# Altium project LG-TRACKER.PrjPcb (part 1 of 2)
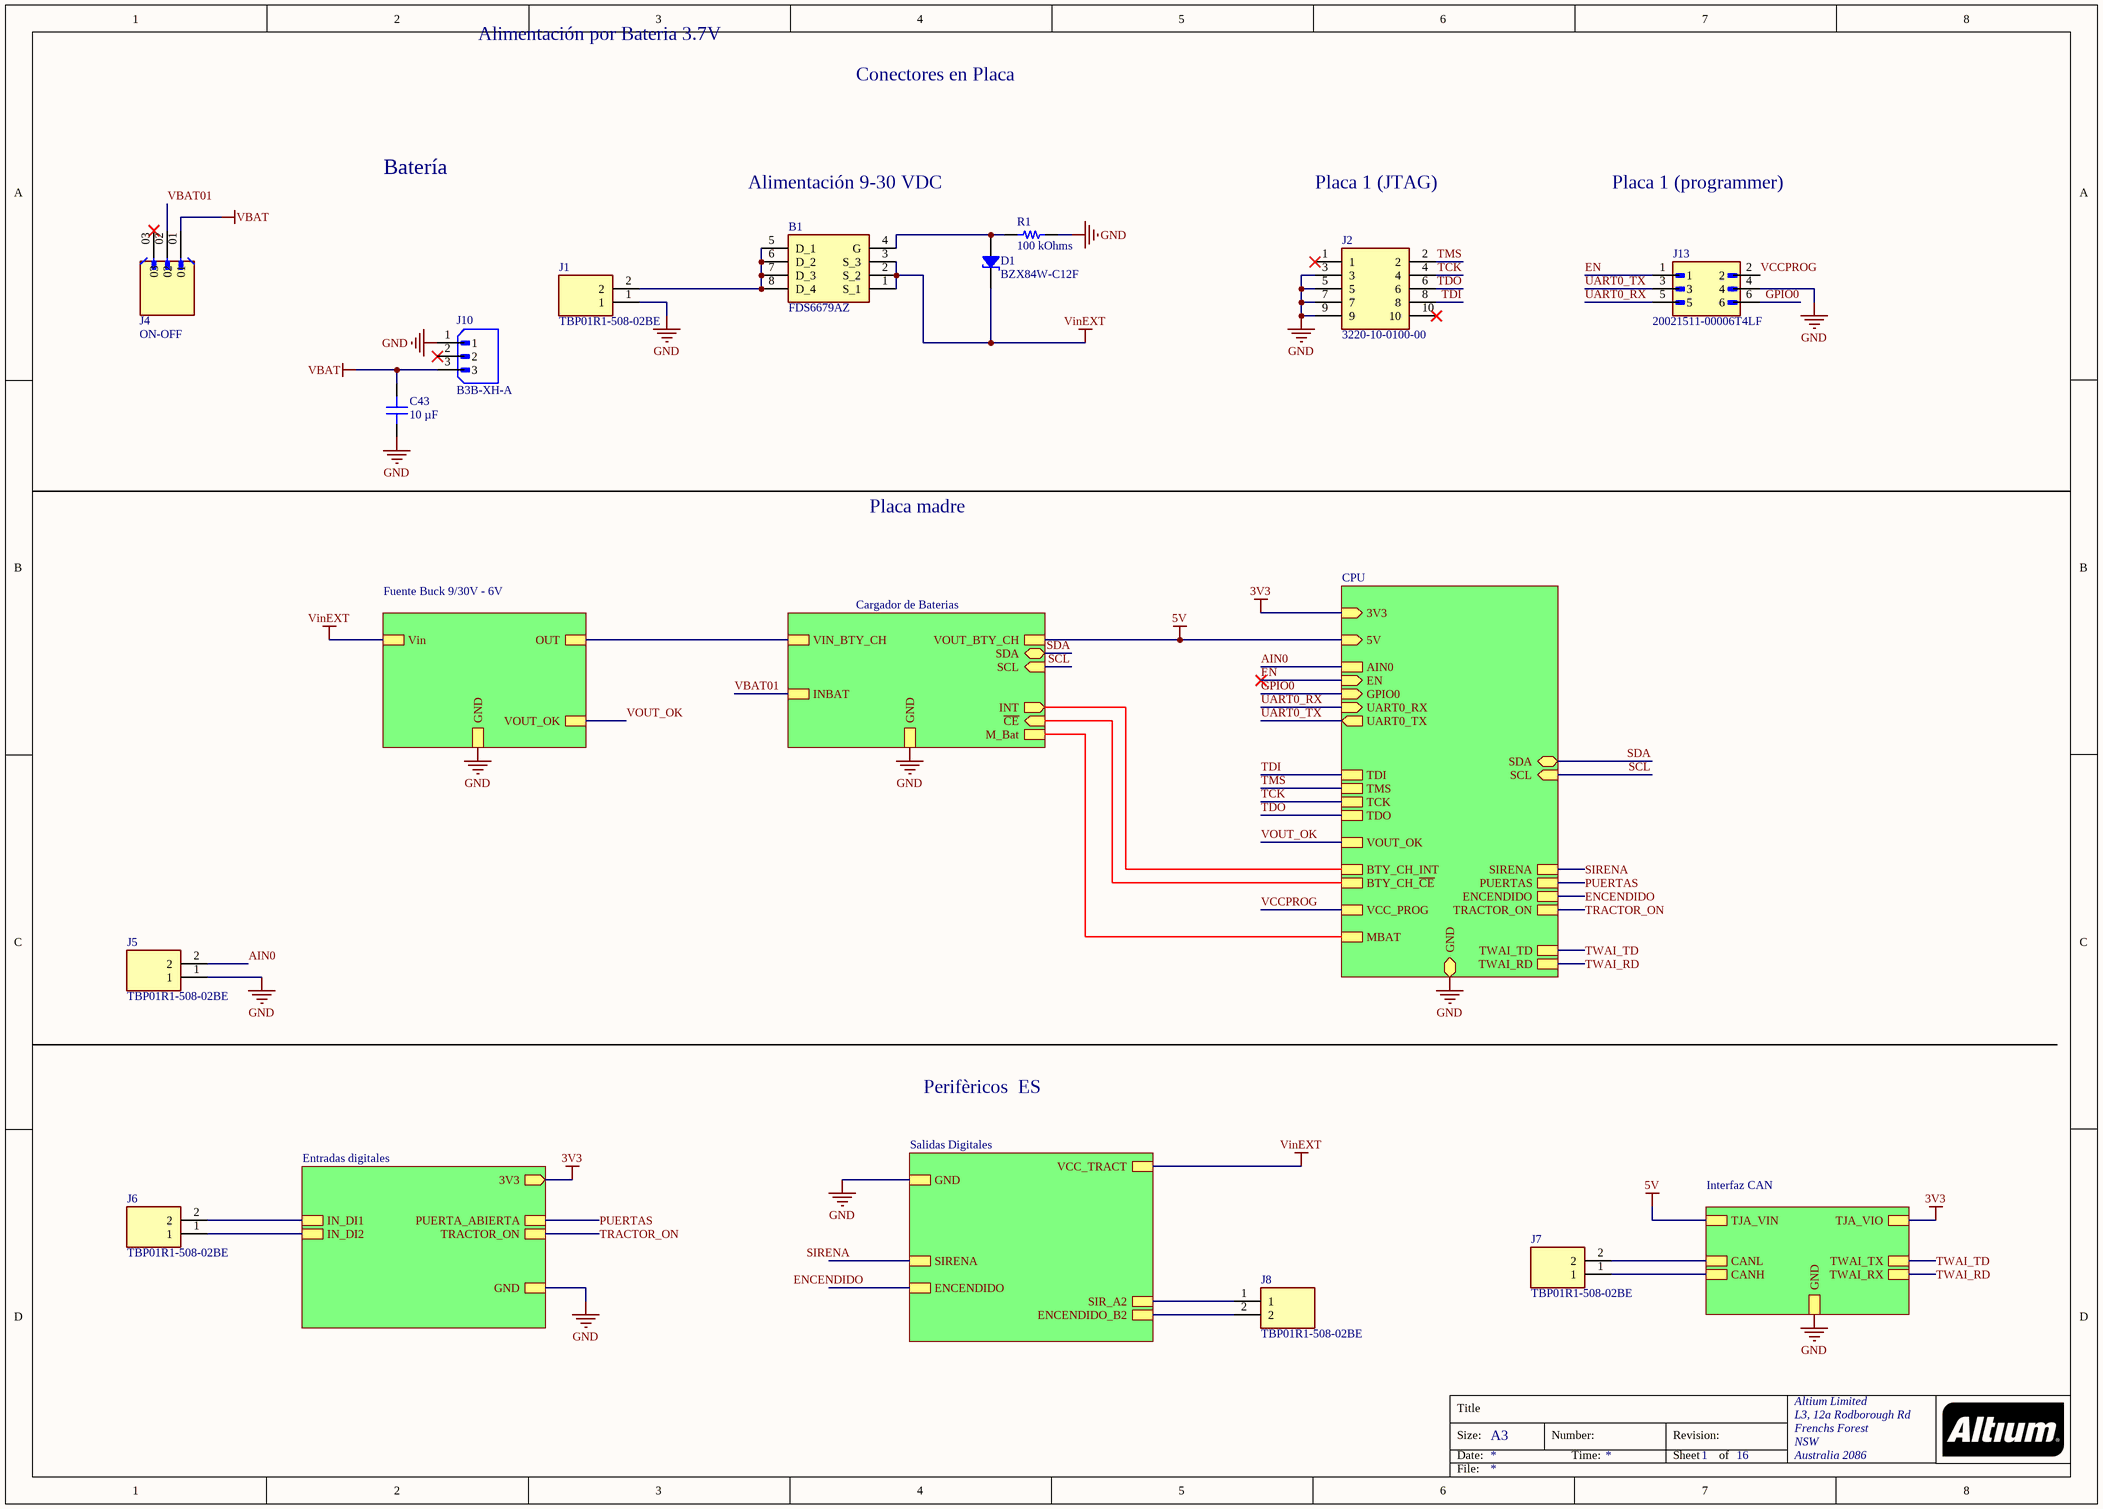
[diagram p0: LG_TRACKER_Block_Diagram.SchDoc]
8 sheets, 81 parts. Net scope: hierarchical (ports join the sheet entries above them; power ports are global).
Board file: LG_TRACKER_PCB.PcbDoc
Sheets:
  LG_TRACKER_Block_Diagram.SchDoc
    CPU = LG_TRACKER_CPU.SchDoc
      Microcontrolador = LG_TRACKER_Microcontroller.SchDoc
        Expansores de IO = LG_TRACKER_IO_Expanders.SchDoc
      GPS = LG_TRACKER_BG95.SchDoc
      Regulador lineal 3V3 = LG_TRACKER_Linear_Voltage_Regulator_3V3.SchDoc
      U_RTU_LMG_LoRa_Module = LG_TRACKER_LoRa_Module.SchDoc
    Salidas Digitales = LG_TRACKER_DO.SchDoc

## Sheet LG_TRACKER_Block_Diagram.SchDoc
size A3; Organization: Altium Limited; Address1: L3, 12a Rodborough Rd; Address2: Frenchs Forest; Address3: NSW; Address4: Australia 2086; SheetNumber: 1; SheetTotal: 16

### Parts
B1  FDS6679AZ  [SOIC127P600X175-8N]
C43  10 µF  [YAGEO RES 0805_2012]
D1  BZX84W-C12F  [SOT65P210X110-3N]
J1  TBP01R1-508-02BE  [CUI_TBP01R1-508-02BE]
J2  3220-10-0100-00  [322010010000]
J4  ON-OFF  [AMPHENOL_68001-203HLF]
J5  TBP01R1-508-02BE  [CUI_TBP01R1-508-02BE]
J6  TBP01R1-508-02BE  [CUI_TBP01R1-508-02BE]
J7  TBP01R1-508-02BE  [CUI_TBP01R1-508-02BE]
J8  TBP01R1-508-02BE  [CUI_TBP01R1-508-02BE]
J10  B3B-XH-A  [JST_B3B-XH-A]
J13  20021511-00006T4LF  [AMPHENOL_20021511-00006T4LF]
R1  100 kOhms  [RES 0603_1608]

### Sub-sheets
Cargador de Baterias = LG_TRACKER_Battery_Charger.SchDoc (file not in this document): SDA (bidir), SCL (in), INT (out), ~{CE} (in), GND, VIN_BTY_CH, VOUT_BTY_CH, M_Bat, INBAT
CPU = LG_TRACKER_CPU.SchDoc: GND (bidir), EN (in), GPIO0 (in), UART0_RX (in), UART0_TX (out), SDA (bidir), SCL (in), TDI, TMS, TCK, TDO, 5V (in), VOUT_OK, BTY_CH_INT, BTY_CH_~{CE}, MBAT, VCC_PROG, 3V3 (in), SIRENA, PUERTAS, ENCENDIDO, TRACTOR_ON, TWAI_TD, TWAI_RD, AIN0
Entradas digitales = LG_TRACKER-DI.SchDoc (file not in this document): IN_DI1, PUERTA_ABIERTA, GND, IN_DI2, TRACTOR_ON, 3V3 (out)
Fuente Buck 9/30V - 6V = LG_TRACKER_LM2596.SchDoc (file not in this document): Vin, GND, OUT, VOUT_OK
Interfaz CAN = LG_TRACKER_CAN.SchDoc (file not in this document): TWAI_TX, TWAI_RX, GND, TJA_VIO, TJA_VIN, CANL, CANH
Salidas Digitales = LG_TRACKER_DO.SchDoc: VCC_TRACT, SIR_A2, SIRENA, GND, ENCENDIDO_B2, ENCENDIDO

### Nets
3V3: sheet CPU/3V3, sheet Entradas digitales/3V3, sheet Interfaz CAN/TJA_VIO
5V: sheet CPU/5V, sheet Cargador de Baterias/VOUT_BTY_CH, sheet Interfaz CAN/TJA_VIN
GND: C43.1 J1.1 J2.3 J2.5 J2.7 J2.9 J5.1 J10.1 J13.4 R1.1 ; sheet CPU/GND, sheet Cargador de Baterias/GND, sheet Fuente Buck 9/30V - 6V/GND, sheet Entradas digitales/GND, sheet Salidas Digitales/GND, sheet Interfaz CAN/GND
VBAT: C43.2 J4.01 J10.3
VinEXT: B1.1(S_1) B1.2(S_2) B1.3(S_3) D1.2 ; sheet Fuente Buck 9/30V - 6V/Vin, sheet Salidas Digitales/VCC_TRACT
AIN0: J5.2 ; sheet CPU/AIN0
BTY_CH_~{CE}: sheet CPU/BTY_CH_~{CE}, sheet Cargador de Baterias/~{CE}
BTY_CH_INT: sheet CPU/BTY_CH_INT, sheet Cargador de Baterias/INT
EN: J13.1 ; sheet CPU/EN
ENCENDIDO: sheet CPU/ENCENDIDO, sheet Salidas Digitales/ENCENDIDO
ENCENDIDO_B2: J8.2 ; sheet Salidas Digitales/ENCENDIDO_B2
GPIO0: J13.6 ; sheet CPU/GPIO0
MBAT: sheet CPU/MBAT, sheet Cargador de Baterias/M_Bat
PUERTAS: sheet CPU/PUERTAS, sheet Entradas digitales/PUERTA_ABIERTA
SCL: sheet CPU/SCL, sheet Cargador de Baterias/SCL
SDA: sheet CPU/SDA, sheet Cargador de Baterias/SDA
SIR_A2: J8.1 ; sheet Salidas Digitales/SIR_A2
SIRENA: sheet CPU/SIRENA, sheet Salidas Digitales/SIRENA
TCK: J2.4 ; sheet CPU/TCK
TDI: J2.8 ; sheet CPU/TDI
TDO: J2.6 ; sheet CPU/TDO
TMS: J2.2 ; sheet CPU/TMS
TRACTOR_ON: sheet CPU/TRACTOR_ON, sheet Entradas digitales/TRACTOR_ON
TWAI_RD: sheet CPU/TWAI_RD, sheet Interfaz CAN/TWAI_RX
TWAI_TD: sheet CPU/TWAI_TD, sheet Interfaz CAN/TWAI_TX
UART0_RX: J13.5 ; sheet CPU/UART0_RX
UART0_TX: J13.3 ; sheet CPU/UART0_TX
VBAT01: J4.02 ; sheet Cargador de Baterias/INBAT
VCCPROG: J13.2 ; sheet CPU/VCC_PROG
VOUT_OK: sheet CPU/VOUT_OK, sheet Fuente Buck 9/30V - 6V/VOUT_OK
NetB1_4: B1.4(G) D1.1 R1.2
NetB1_5: B1.5(D_1) B1.6(D_2) B1.7(D_3) B1.8(D_4) J1.2
NetJ6_1: J6.1 ; sheet Entradas digitales/IN_DI2
NetJ6_2: J6.2 ; sheet Entradas digitales/IN_DI1
NetJ7_1: J7.1 ; sheet Interfaz CAN/CANH
NetJ7_2: J7.2 ; sheet Interfaz CAN/CANL
(unnamed): sheet Cargador de Baterias/VIN_BTY_CH, sheet Fuente Buck 9/30V - 6V/OUT

Not connected (* = marked no-connect by the designer): J2 1* 10*; J4 03*; J10 2*

### Notes on the sheet
- Alimentación por Bateria 3.7V
- Conectores en Placa
- Batería
- Alimentación 9-30 VDC
- Placa 1 (JTAG)
- Placa 1 (programmer)
- Placa madre
- Perifèricos  ES
- Title
- Size:
- Date:
- A3
- Number:
- Time:
- Revision:
- Sheet
- of
- File:

### Library data of the parts
B1 = FDS6679AZ: Max rDS(on) = 14.8m at VGS = -4.5V, ID = -11A; HBM ESD protection level of 6kV typical (note 3); High power and current handing capability; Extended VGS range (-25V) for battery applications; High performance trench technology for extremely lowrDS(on); High power and current handing capability; Max rDS(on) = 9.3mat VGS = -10V, ID = -13A; Manufacturer_Name: onsemi; Geometry.Height: 1.75mm; Mouser Part Number: 512-FDS6679AZ; Mouser Price/Stock: https://www.mouser.co.uk/ProductDetail/onsemi-Fairchild/FDS6679AZ?qs=vnwGVgFuQiZlXnM8io%2FtYg%3D%3D; Manufacturer_Part_Number: FDS6679AZ; Datasheet Link: https://www.onsemi.com/pub/Collateral/FDS6679AZ-D.PDF
C43 = CL21A106KOQNNNE: CAP CER 10UF 16V X5R 0805; manufacturer: Samsung Electro-Mechanics; Tolerance: ±10%; Part Number: CL21A106KOQNNNE; Value: 10 µF; Applications: General Purpose; Capacitance: 10 µF; componentlink1description: Datasheet; componentlink1url: http://www.samsungsem.com/kr/support/product-search/mlcc/CL21A106KOQNNNE.jsp; componentlink2description: DigiKey Link; componentlink2url: https://www.digikey.com/en/products/detail/samsung-electro-mechanics/CL21A106KOQNNNE/3886754; Device Package: 0805 (2012 Metric); lastupdated: 10/30/2023 7:13:57 PM; Lifecycle Status: Active; Minimum Order: 1; Mounting Type: Surface Mount, MLCC; Operating Temperature: -55°C ~ 85°C; Package / Case: 0805 (2012 Metric); packaging: TapeAndReel; partid: 14297; Part Status: Active; price: 0.01; series: CL; Size / Dimension: 0.079" L x 0.049" W (2.00mm x 1.25mm); Supplier 1: DigiKey; Supplier Part Number 1: 1276-1096-1-ND; Temperature Coefficient: X5R; Thickness (Max): 0.055" (1.40mm); Voltage - Rated: 16V
D1 = BZX84W-C12F: DIODE ZENER 12V 275MW SOT323; Manufacturer: Nexperia USA Inc.; Current - Reverse Leakage @ Vr: 100 nA @ 8 V; Impedance (Max) (Zzt): 25 Ohms; Tolerance: ±5%; Voltage - Forward (Vf) (Max) @ If: 900 mV @ 10 mA; Part Number: BZX84W-C12F; ComponentLink1Description: Datasheet; ComponentLink1URL: https://assets.nexperia.com/documents/data-sheet/BZX84W_SER.pdf; ComponentLink2Description: DigiKey Link; ComponentLink2URL: https://www.digikey.com/en/products/detail/nexperia-usa-inc/BZX84W-C12F/9380703; LastUpdated: 3/6/2024 20:01:46; Lifecycle Status: Active; Minimum Order: 1; Mounting Type: Surface Mount; Operating Temperature: 150°C (TJ); Package / Case: SC-70, SOT-323; Packaging: TapeAndReel; PartId: 873; Part Status: Active; Power - Max: 275 mW; Price: 0.01; Series: BZX84W; Supplier 1: DigiKey; Supplier Part Number 1: 1727-8288-1-ND; Supplier Device Package: SOT-323; Voltage - Zener (Nom) (Vz): 12 V
J1 J5-J8 = TBP01R1-508-02BE: 2~24 Poles, Pluggable, Receptacle, Horizontal, 5.08 Pitch, Terminal Block Connector; MF: Same Sky; SnapEDA_Link: https://www.snapeda.com/parts/TBP01R1-508-02BE/Same+Sky/view-part/?ref=snap; Package: None; Value: *; MP: TBP01R1-508-02BE; Check_prices: https://www.snapeda.com/parts/TBP01R1-508-02BE/Same+Sky/view-part/?ref=eda
J2 = 3220-10-0100-00: Connector Header Through Hole 10 position Shrouded 4 wall 0.050" (1.27mm); Manufacturer_Name: CNC Tech; Datasheet Link: https://datasheet.datasheetarchive.com/originals/dk/DKDS-7/133059.pdf; Height: 5.6mm; Manufacturer_Part_Number: 3220-10-0100-00; Arrow Part Number: 3220-10-0100-00; Arrow Price/Stock: https://www.arrow.com/en/products/3220-10-0100-00/cnc-tech-llc?region=nac
J4 = 68001-203HLF: Board to Board connector, Unshrouded vertical header, Through Hole, Single Row, , 3 Positions, 2.54 mm (0.100in) Pitch.; MF: Amphenol ICC; Package: None; Price: None; Check_prices: https://www.snapeda.com/parts/68001-203HLF/Amphenol+FCI/view-part/?ref=eda; Value: *; SnapEDA_Link: https://www.snapeda.com/parts/68001-203HLF/Amphenol+FCI/view-part/?ref=snap; MP: 68001-203HLF; Availability: In Stock; Purchase-URL: https://pricing.snapeda.com/search?q=68001-203HLF&ref=eda; ComponentLink1Description: New link; ComponentLink1URL: https://www.digikey.com/es/products/detail/amphenol-cs-fci/68001-203HLF/2023312
J10 = B3B-XH-A: Connector Header Through Hole 3 position 0.098 (2.50mm); MF: JST Sales; SnapEDA_Link: https://www.snapeda.com/parts/B3B-XH-A/JST+Sales+America+Inc./view-part/?ref=snap; Package: None; Value: *; MP: B3B-XH-A; Check_prices: https://www.snapeda.com/parts/B3B-XH-A/JST+Sales+America+Inc./view-part/?ref=eda
J13 = 20021511-00006T4LF: 1.27mm (0.05in.) pitch, Shrouded header, 6 contacts; MF: Amphenol ICC (FCI); SnapEDA_Link: https://www.snapeda.com/parts/20021511-00006T4LF/Amphenol+FCI/view-part/?ref=snap; Package: None; Value: *; MP: 20021511-00006T4LF; Check_prices: https://www.snapeda.com/parts/20021511-00006T4LF/Amphenol+FCI/view-part/?ref=eda
R1 = RNCS0603BKE100K: RES 100K OHM 0.1% 1/16W 0603; Manufacturer: Stackpole Electronics Inc; Power (Watts): 0.063W, 1/16W; Temperature Coefficient: ±25ppm/°C; Part Number: RNCS0603BKE100K; Value: 100 kOhms; ComponentLink1Description: Datasheet; ComponentLink1URL: https://www.seielect.com/catalog/sei-rncs_rnch.pdf; ComponentLink2Description: DigiKey Link; ComponentLink2URL: https://www.digikey.com/en/products/detail/stackpole-electronics-inc/RNCS0603BKE100K/1708835; Composition: Thin Film; Device Package: 0603 (1608 Metric); Features: Anti-Corrosive, Automotive AEC-Q200, Moisture Resistant; Height - Seated (Max): 0.022" (0.55mm); LastUpdated: 9/2/2024 20:43:37; Lifecycle Status: Active; Minimum Order: 1; Number of Terminations: 2; Operating Temperature: -55°C ~ 155°C; Package / Case: 0603 (1608 Metric); Packaging: TapeAndReel; PartId: 4849; Part Status: Active; Price: 0.06; Ratings: AEC-Q200; Resistance: 100 kOhms; Series: RNCS; Size / Dimension: 0.061" L x 0.031" W (1.55mm x 0.80mm); Supplier 1: DigiKey; Supplier Part Number 1: RNCS0603BKE100KCT-ND; Supplier Device Package: 0603; Tolerance: ±0.1%

## Sheet LG_TRACKER_CPU.SchDoc
size A2; Organization: Altium Limited; Address1: L3, 12a Rodborough Rd; Address2: Frenchs Forest; Address3: NSW; Address4: Australia 2086; SheetNumber: 2; SheetTotal: 16
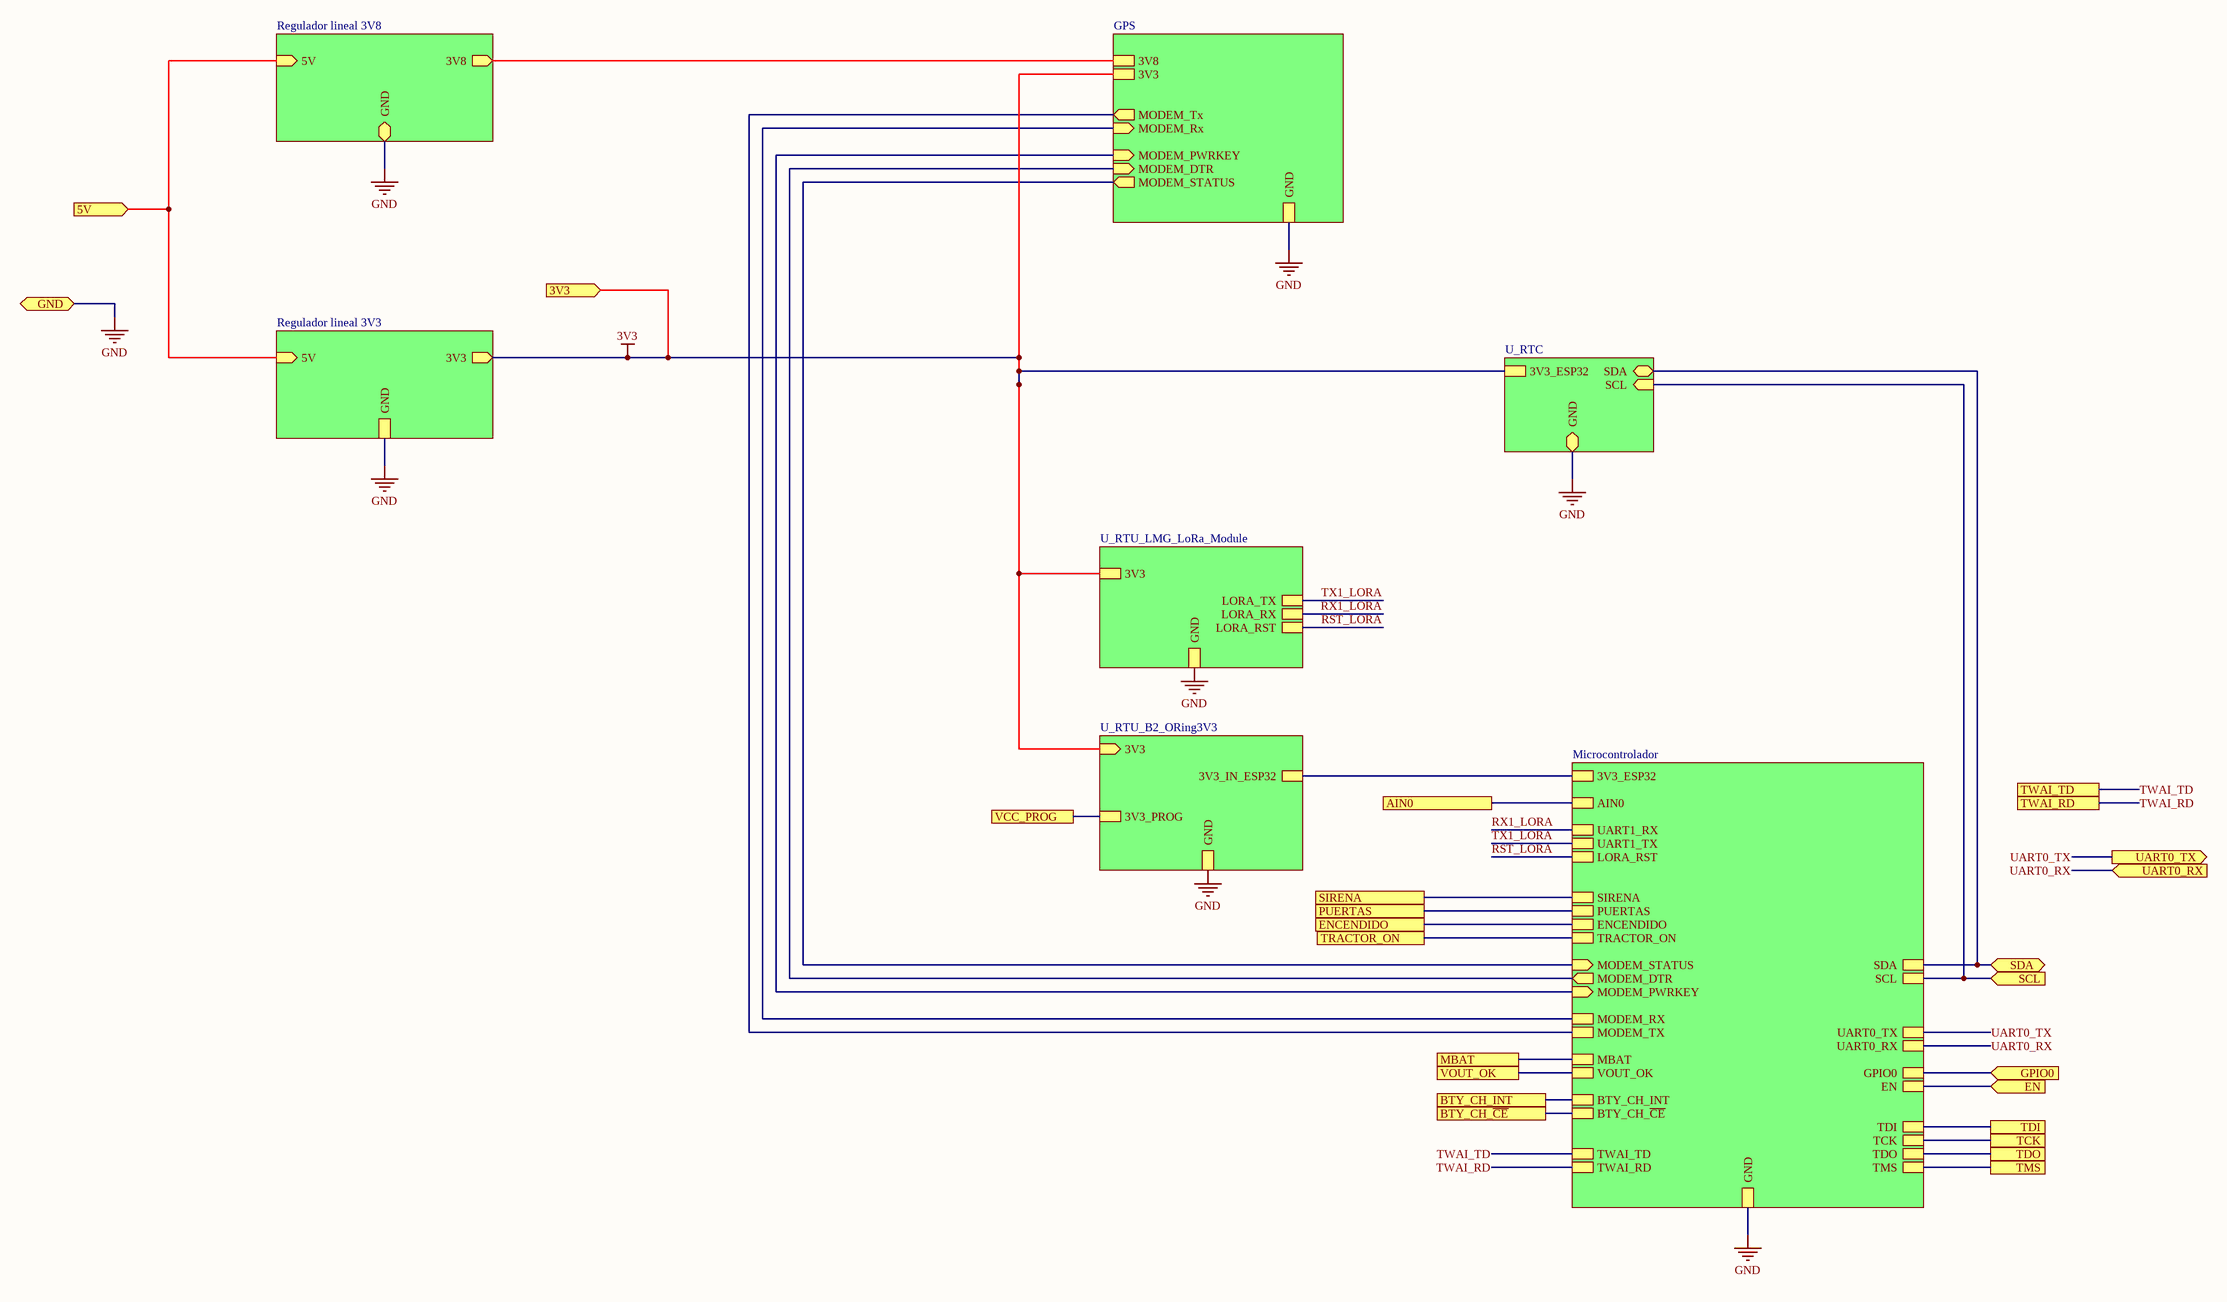
[diagram p1: LG_TRACKER_CPU.SchDoc]

### Sub-sheets
GPS = LG_TRACKER_BG95.SchDoc: 3V3, 3V8, GND, MODEM_Rx (in), MODEM_PWRKEY (in), MODEM_Tx (out), MODEM_DTR (in), MODEM_STATUS (out)
Microcontrolador = LG_TRACKER_Microcontroller.SchDoc: MODEM_TX, EN, MODEM_RX, UART0_TX, UART0_RX, SDA, SCL, MODEM_DTR (out), MODEM_STATUS (in), GPIO0, GND, MODEM_PWRKEY (in), TDI, TCK, TDO, TMS, BTY_CH_INT, BTY_CH_~{CE}, VOUT_OK, MBAT, 3V3_ESP32, LORA_RST, UART1_TX, UART1_RX, TWAI_TD, TWAI_RD, SIRENA, PUERTAS, ENCENDIDO, TRACTOR_ON, AIN0
Regulador lineal 3V3 = LG_TRACKER_Linear_Voltage_Regulator_3V3.SchDoc: GND, 3V3 (out), 5V (in)
Regulador lineal 3V8 = LG_TRACKER_Linear_Voltage_Regulator_3V8.SchDoc (file not in this document): GND (bidir), 3V8 (out), 5V (in)
U_RTC = LG_TRACKER_RTC.SchDoc (file not in this document): SDA (bidir), SCL (in), GND (bidir), 3V3_ESP32
U_RTU_B2_ORing3V3 = LG_TRACKER_ORing3V3.SchDoc (file not in this document): 3V3_PROG, 3V3_IN_ESP32, GND, 3V3 (in)
U_RTU_LMG_LoRa_Module = LG_TRACKER_LoRa_Module.SchDoc: LORA_RST, LORA_TX, LORA_RX, 3V3, GND

### Ports
3V3 (in), 5V (in), AIN0, BTY_CH_INT, BTY_CH_~{CE}, EN (in), ENCENDIDO, GND (bidir), GPIO0 (in), MBAT, PUERTAS, SCL (in), SDA (bidir), SIRENA, TCK, TDI, TDO, TMS, TRACTOR_ON, TWAI_RD, TWAI_TD, UART0_RX (in), UART0_TX (out), VCC_PROG, VOUT_OK

### Nets
3V3: port 3V3, sheet GPS/3V3, sheet Regulador lineal 3V3/3V3, sheet U_RTU_B2_ORing3V3/3V3, sheet U_RTC/3V3_ESP32, sheet U_RTU_LMG_LoRa_Module/3V3
3V3_ESP32: sheet Microcontrolador/3V3_ESP32, sheet U_RTU_B2_ORing3V3/3V3_IN_ESP32
3V8: sheet GPS/3V8, sheet Regulador lineal 3V8/3V8
5V: port 5V, sheet Regulador lineal 3V3/5V, sheet Regulador lineal 3V8/5V
GND: port GND, sheet Microcontrolador/GND, sheet GPS/GND, sheet Regulador lineal 3V3/GND, sheet Regulador lineal 3V8/GND, sheet U_RTU_B2_ORing3V3/GND, sheet U_RTC/GND, sheet U_RTU_LMG_LoRa_Module/GND
AIN0: port AIN0, sheet Microcontrolador/AIN0
BTY_CH_~{CE}: port BTY_CH_~{CE}, sheet Microcontrolador/BTY_CH_~{CE}
BTY_CH_INT: port BTY_CH_INT, sheet Microcontrolador/BTY_CH_INT
EN: port EN, sheet Microcontrolador/EN
ENCENDIDO: port ENCENDIDO, sheet Microcontrolador/ENCENDIDO
GPIO0: port GPIO0, sheet Microcontrolador/GPIO0
MBAT: port MBAT, sheet Microcontrolador/MBAT
MODEM_DTR: sheet Microcontrolador/MODEM_DTR, sheet GPS/MODEM_DTR
MODEM_PWRKEY: sheet Microcontrolador/MODEM_PWRKEY, sheet GPS/MODEM_PWRKEY
MODEM_RX: sheet Microcontrolador/MODEM_RX, sheet GPS/MODEM_Rx
MODEM_STATUS: sheet Microcontrolador/MODEM_STATUS, sheet GPS/MODEM_STATUS
MODEM_TX: sheet Microcontrolador/MODEM_TX, sheet GPS/MODEM_Tx
PUERTAS: port PUERTAS, sheet Microcontrolador/PUERTAS
RST_LORA: sheet Microcontrolador/LORA_RST, sheet U_RTU_LMG_LoRa_Module/LORA_RST  [project net LORA_RST]
RX1_LORA: sheet Microcontrolador/UART1_RX, sheet U_RTU_LMG_LoRa_Module/LORA_RX  [project net LORA_RX_1]
SCL: port SCL, sheet Microcontrolador/SCL, sheet U_RTC/SCL
SDA: port SDA, sheet Microcontrolador/SDA, sheet U_RTC/SDA
SIRENA: port SIRENA, sheet Microcontrolador/SIRENA
TCK: port TCK, sheet Microcontrolador/TCK
TDI: port TDI, sheet Microcontrolador/TDI
TDO: port TDO, sheet Microcontrolador/TDO
TMS: port TMS, sheet Microcontrolador/TMS
TRACTOR_ON: port TRACTOR_ON, sheet Microcontrolador/TRACTOR_ON
TWAI_RD: port TWAI_RD, sheet Microcontrolador/TWAI_RD
TWAI_TD: port TWAI_TD, sheet Microcontrolador/TWAI_TD
TX1_LORA: sheet Microcontrolador/UART1_TX, sheet U_RTU_LMG_LoRa_Module/LORA_TX  [project net LORA_TX_1]
UART0_RX: port UART0_RX, sheet Microcontrolador/UART0_RX
UART0_TX: port UART0_TX, sheet Microcontrolador/UART0_TX
VCCPROG: port VCC_PROG, sheet U_RTU_B2_ORing3V3/3V3_PROG
VOUT_OK: port VOUT_OK, sheet Microcontrolador/VOUT_OK

### Notes on the sheet
- Title
- Size:
- Date:
- File:
- A2
- Number:
- Time:
- Revision:
- Sheet
- of

## Sheet LG_TRACKER_Microcontroller.SchDoc
size B; Organization: Altium Limited; Address1: L3, 12a Rodborough Rd; Address2: Frenchs Forest; Address3: NSW; Address4: Australia 2086; SheetNumber: 5; SheetTotal: 16
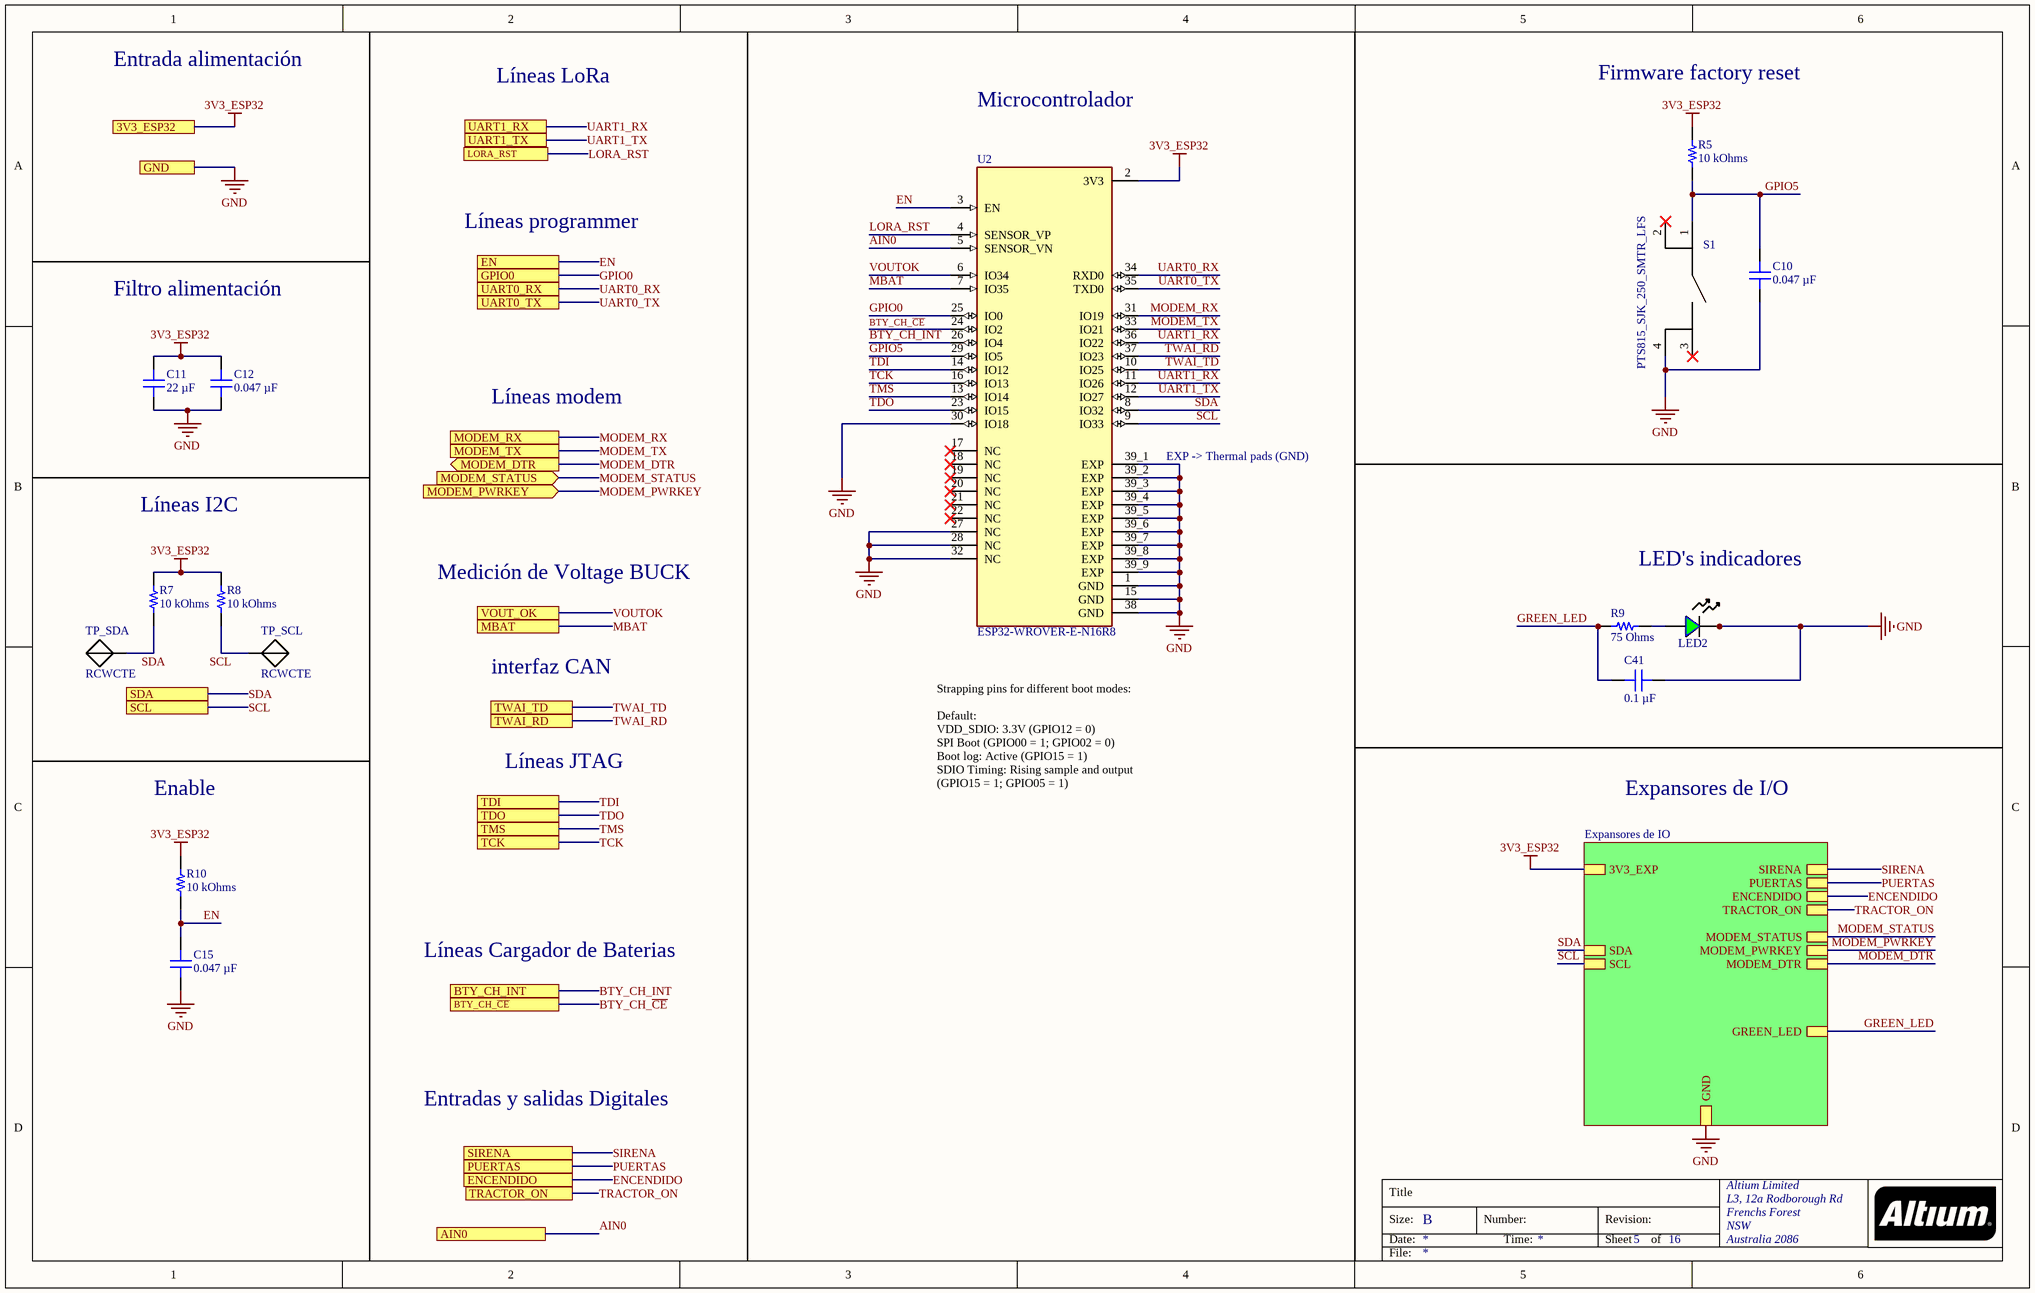
[diagram p2: LG_TRACKER_Microcontroller.SchDoc]

### Parts
C10  0.047 µF  [CAP 0603_1608]
C11  22 µF  [CAP 0805_2012]
C12  0.047 µF  [CAP 0603_1608]
C15  0.047 µF  [CAP 0603_1608]
C41  0.1 µF  [CAP 0402_1005]
LED2  LTST-C170GKT  [0805 SMD - LED]  (value not drawn)
R5  10 kOhms  [RES 0603_1608]
R7  10 kOhms  [RES 0603_1608]
R8  10 kOhms  [RES 0603_1608]
R9  75 Ohms  [RES 0402_1005]
R10  10 kOhms  [RES 0603_1608]
S1  PTS815_SJK_250_SMTR_LFS  [PTS815SJK250SMTRLFS]
TP_SCL  RCWCTE  [RCWCTE]
TP_SDA  RCWCTE  [RCWCTE]
U2  ESP32-WROVER-E-N16R8  [ESP32-WROVER-E-N16R8]

### Sub-sheets
Expansores de IO = LG_TRACKER_IO_Expanders.SchDoc: GND, MODEM_STATUS, MODEM_PWRKEY, MODEM_DTR, GREEN_LED, SDA, SCL, 3V3_EXP, SIRENA, PUERTAS, ENCENDIDO, TRACTOR_ON

### Ports
3V3_ESP32, AIN0, BTY_CH_INT, BTY_CH_~{CE}, EN, ENCENDIDO, GND, GPIO0, LORA_RST, MBAT, MODEM_DTR (out), MODEM_PWRKEY (in), MODEM_RX, MODEM_STATUS (in), MODEM_TX, PUERTAS, SCL, SDA, SIRENA, TCK, TDI, TDO, TMS, TRACTOR_ON, TWAI_RD, TWAI_TD, UART0_RX, UART0_TX, UART1_RX, UART1_TX, VOUT_OK

### Nets
3V3_ESP32: C11.2 C12.2 R5.2 R7.2 R8.2 R10.2 U2.2(3V3) ; port 3V3_ESP32, sheet Expansores de IO/3V3_EXP
GND: C10.1 C11.1 C12.1 C15.1 C41.1 LED2.K(CATHODE) S1.4(N.O._2) U2.1(GND) U2.15(GND) U2.27(NC) U2.28(NC) U2.30(IO18) U2.32(NC) U2.38(GND) U2.39_1(EXP) U2.39_2(EXP) U2.39_3(EXP) U2.39_4(EXP) U2.39_5(EXP) U2.39_6(EXP) U2.39_7(EXP) U2.39_8(EXP) U2.39_9(EXP) ; port GND, sheet Expansores de IO/GND
AIN0: U2.5(SENSOR_VN) ; port AIN0
BTY_CH_~{CE}: U2.24(IO2) ; port BTY_CH_~{CE}
BTY_CH_INT: U2.26(IO4) ; port BTY_CH_INT
EN: C15.2 R10.1 U2.3(EN) ; port EN
ENCENDIDO: port ENCENDIDO, sheet Expansores de IO/ENCENDIDO
GPIO0: U2.25(IO0) ; port GPIO0
GPIO5: C10.2 R5.1 S1.1(COM_1) U2.29(IO5)
GREEN_LED: C41.2 R9.1 ; sheet Expansores de IO/GREEN_LED
LORA_RST: U2.4(SENSOR_VP) ; port LORA_RST
MBAT: U2.7(IO35) ; port MBAT
MODEM_DTR: port MODEM_DTR, sheet Expansores de IO/MODEM_DTR
MODEM_PWRKEY: port MODEM_PWRKEY, sheet Expansores de IO/MODEM_PWRKEY
MODEM_RX: U2.31(IO19) ; port MODEM_RX
MODEM_STATUS: port MODEM_STATUS, sheet Expansores de IO/MODEM_STATUS
MODEM_TX: U2.33(IO21) ; port MODEM_TX
PUERTAS: port PUERTAS, sheet Expansores de IO/PUERTAS
SCL: R8.1 TP_SCL.1(TP) U2.9(IO33) ; port SCL, sheet Expansores de IO/SCL
SDA: R7.1 TP_SDA.1(TP) U2.8(IO32) ; port SDA, sheet Expansores de IO/SDA
SIRENA: port SIRENA, sheet Expansores de IO/SIRENA
TCK: U2.16(IO13) ; port TCK
TDI: U2.14(IO12) ; port TDI
TDO: U2.23(IO15) ; port TDO
TMS: U2.13(IO14) ; port TMS
TRACTOR_ON: port TRACTOR_ON, sheet Expansores de IO/TRACTOR_ON
TWAI_RD: U2.37(IO23) ; port TWAI_RD
TWAI_TD: U2.10(IO25) ; port TWAI_TD
UART0_RX: U2.34(RXD0) ; port UART0_RX
UART0_TX: U2.35(TXD0) ; port UART0_TX
UART1_RX: U2.11(IO26) U2.36(IO22) ; port UART1_RX  [project net LORA_RX_1]
UART1_TX: U2.12(IO27) ; port UART1_TX  [project net LORA_TX_1]
VOUTOK: U2.6(IO34) ; port VOUT_OK  [project net VOUT_OK]
NetLED2_A: LED2.A(ANODE) R9.2

Not connected (* = marked no-connect by the designer): S1 2(COM_2)* 3(N.O._1)*; U2 17(NC)* 18(NC)* 19(NC)* 20(NC)* 21(NC)* 22(NC)*

### Notes on the sheet
- Entrada alimentación
- Líneas LoRa
- Firmware factory reset
- Microcontrolador
- Líneas programmer
- Filtro alimentación
- Líneas modem
- EXP -> Thermal pads (GND)
- Líneas I2C
- LED's indicadores
- Medición de Voltage BUCK
- interfaz CAN
- Líneas JTAG
- Enable
- Strapping pins for different boot modes:
  Default:
  VDD_SDIO: 3.3V (GPIO12 = 0)
  SPI Boot (GPIO00 = 1; GPIO02 = 0)
  Boot log: Active (GPIO15 = 1)
  SDIO Timing: Rising sample and output (GPIO15 = 1; GPIO05 = 1)
- Expansores de I/O
- Líneas Cargador de Baterias
- Entradas y salidas Digitales
- Title
- Size:
- Date:
- B
- Number:
- Time:
- Revision:
- Sheet
- of
- File:

### Library data of the parts
C10 C12 C15 = 885012206118: CAP CER 0.047UF 100V X7R 0603; manufacturer: Würth Elektronik; Tolerance: ±10%; Part Number: 885012206118; Value: 0.047 µF; Applications: General Purpose; Capacitance: 0.047 µF; componentlink1description: Datasheet; componentlink1url: https://katalog.we-online.de/pbs/datasheet/885012206118.pdf; componentlink2description: DigiKey Link; componentlink2url: https://www.digikey.com/en/products/detail/würth-elektronik/885012206118/9346004; Device Package: 0603 (1608 Metric); lastupdated: 10/29/2023 7:09:06 PM; Lifecycle Status: Active; Minimum Order: 1; Mounting Type: Surface Mount, MLCC; Operating Temperature: -55°C ~ 125°C; Package / Case: 0603 (1608 Metric); packaging: TapeAndReel; partid: 11891; Part Status: Active; price: 0.06; series: WCAP-CSGP; Size / Dimension: 0.063" L x 0.031" W (1.60mm x 0.80mm); Supplier 1: DigiKey; Supplier Part Number 1: 732-12192-1-ND; Temperature Coefficient: X7R; Thickness (Max): 0.037" (0.95mm); Voltage - Rated: 100V
C11 = CL21A226MOCLRNC: CAP CER 22UF 16V X5R 0805; manufacturer: Samsung Electro-Mechanics; Tolerance: ±20%; Part Number: CL21A226MOCLRNC; Value: 22 µF; Applications: General Purpose; Capacitance: 22 µF; componentlink1description: Datasheet; componentlink1url: http://www.samsungsem.com/kr/support/product-search/mlcc/CL21A226MOCLRNC.jsp; componentlink2description: DigiKey Link; componentlink2url: https://www.digikey.com/en/products/detail/samsung-electro-mechanics/CL21A226MOCLRNC/5961264; Device Package: 0805 (2012 Metric); Features: Low Profile; lastupdated: 10/30/2023 7:14:19 PM; Lifecycle Status: Active; Minimum Order: 1; Mounting Type: Surface Mount, MLCC; Operating Temperature: -55°C ~ 85°C; Package / Case: 0805 (2012 Metric); packaging: TapeAndReel; partid: 4767; Part Status: Active; price: 0.05; series: CL; Size / Dimension: 0.079" L x 0.049" W (2.00mm x 1.25mm); Supplier 1: DigiKey; Supplier Part Number 1: 1276-6780-1-ND; Temperature Coefficient: X5R; Thickness (Max): 0.037" (0.95mm); Voltage - Rated: 16V
C41 = CGA2B3X5R1H104M050BB: CAP CER 0.1UF 50V X5R 0402; manufacturer: TDK Corporation; Tolerance: ±20%; Part Number: CGA2B3X5R1H104M050BB; Capacitance: 0.1 µF; Applications: Automotive; componentlink1description: Datasheet; componentlink1url: https://product.tdk.com/info/en/catalog/datasheets/mlcc_automotive_general_en.pdf?ref_disty=digikey; componentlink2description: DigiKey Link; componentlink2url: https://www.digikey.com/en/products/detail/tdk-corporation/CGA2B3X5R1H104M050BB/3949450; Device Package: 0402 (1005 Metric); lastupdated: 9/2/2024 20:04:38; Lifecycle Status: Active; Minimum Order: 1; Mounting Type: Surface Mount, MLCC; Operating Temperature: -55°C ~ 85°C; Package / Case: 0402 (1005 Metric); packaging: TapeAndReel; partid: 1792; Part Status: Active; price: 0.01; Ratings: AEC-Q200; series: CGA; Size / Dimension: 0.039" L x 0.020" W (1.00mm x 0.50mm); Supplier 1: DigiKey; Supplier Part Number 1: 445-12214-1-ND; Temperature Coefficient: X5R; Thickness (Max): 0.022" (0.55mm); value: 0.1 µF; Voltage - Rated: 50V
LED2 = LTST-C170GKT: LED verde SMD (0805); Mfr_Name: Wolfspeed; Type: DEV; Copyright: Copyright (C) 2023 Ultra Librarian. All rights reserved.; Manufacturer_Part_Number: LTST-C170GKT; RefDes: RefDes
R5 R7 R8 R10 = RC0603FR-0710KL: RES 10K OHM 1% 1/10W 0603; Manufacturer: Yageo; Power (Watts): 0.1W, 1/10W; Temperature Coefficient: ±100ppm/°C; Part Number: RC0603FR-0710KL; Value: 10 kOhms; ComponentLink1Description: Datasheet; ComponentLink1URL: https://www.yageo.com/upload/media/product/productsearch/datasheet/rchip/PYu-RC_Group_51_RoHS_L_10.pdf; ComponentLink2Description: DigiKey Link; ComponentLink2URL: https://www.digikey.com/en/products/detail/yageo/RC0603FR-0710KL/726880; Composition: Thick Film; Device Package: 0603 (1608 Metric); Features: Moisture Resistant; Height - Seated (Max): 0.022" (0.55mm); LastUpdated: 10/30/2023 7:36:43 PM; Lifecycle Status: Active; Minimum Order: 1; Number of Terminations: 2; Operating Temperature: -55°C ~ 155°C; Package / Case: 0603 (1608 Metric); Packaging: CutTape; PartId: 22599; Part Status: Active; Price: 0.01; Resistance: 10 kOhms; Series: RC_L; Size / Dimension: 0.063" L x 0.031" W (1.60mm x 0.80mm); Supplier 1: DigiKey; Supplier Part Number 1: 311-10.0KHRCT-ND; Supplier Device Package: 0603; Tolerance: ±1%
R9 = CRCW040275R0FKEDC: RES 75 OHM 1% 1/16W 0402; Manufacturer: Vishay Dale; Power (Watts): 0.063W, 1/16W; Temperature Coefficient: ±100ppm/°C; Part Number: CRCW040275R0FKEDC; Value: 75 Ohms; ComponentLink1Description: Datasheet; ComponentLink1URL: http://www.vishay.com/docs/28773/crcwce3.pdf; ComponentLink2Description: DigiKey Link; ComponentLink2URL: https://www.digikey.com/en/products/detail/vishay-dale/CRCW040275R0FKEDC/7928421; Composition: Thick Film; Device Package: 0402 (1005 Metric); Height - Seated (Max): 0.014" (0.35mm); LastUpdated: 11/3/2023 7:28:02 PM; Lifecycle Status: Active; Minimum Order: 1; Number of Terminations: 2; Operating Temperature: -55°C ~ 155°C; Package / Case: 0402 (1005 Metric); Packaging: CutTape; PartId: 16117; Part Status: Active; Price: 0.01; Resistance: 75 Ohms; Series: CRCW-C; Size / Dimension: 0.039" L x 0.020" W (1.00mm x 0.50mm); Supplier 1: DigiKey; Supplier Part Number 1: 541-3999-1-ND; Supplier Device Package: 0402; Tolerance: ±1%
S1 = PTS815_SJK_250_SMTR_LFS: Switch; Manufacturer_Name: C & K COMPONENTS; Manufacturer_Part_Number: PTS815 SJK 250 SMTR LFS; Datasheet Link: https://www.mouser.com/datasheet/2/60/pts815-1535658.pdf; Height: 2mm; Mouser Part Number: 611-PTS815SJK250SMTR; Mouser Price/Stock: https://www.mouser.co.uk/ProductDetail/CK/PTS815-SJK-250-SMTR-LFS?qs=ahcBuItHZ3yETpGYMHf%2FgQ%3D%3D; Arrow Part Number: PTS815 SJK 250 SMTR LFS; Arrow Price/Stock: https://www.arrow.com/en/products/pts815-sjk-250-smtr-lfs/ck
TP_SCL TP_SDA = RCWCTE: - PC Test Point - - Plating Surface Mount Mounting Type; MF: KOA Speer; Check_prices: https://www.snapeda.com/parts/RCWCTE/KOA+Speer/view-part/?ref=eda; SnapEDA_Link: https://www.snapeda.com/parts/RCWCTE/KOA+Speer/view-part/?ref=snap; Digi-Key_Part_Number: 2019-RCWCTETR-ND; Value: *; Purchase-URL: https://pricing.snapeda.com/search/part/RCWCTE/?ref=eda; Package: None; MP: RCWCTE
U2 = ESP32-WROVER-E-N16R8: Bluetooth, WiFi 802.11b/g/n, Bluetooth v4.2 +EDR Transceiver Module 2.4GHz ~ 2.5GHz PCB Trace Surface Mount

## Sheet LG_TRACKER_IO_Expanders.SchDoc
size B; SheetNumber: 6; SheetTotal: 17
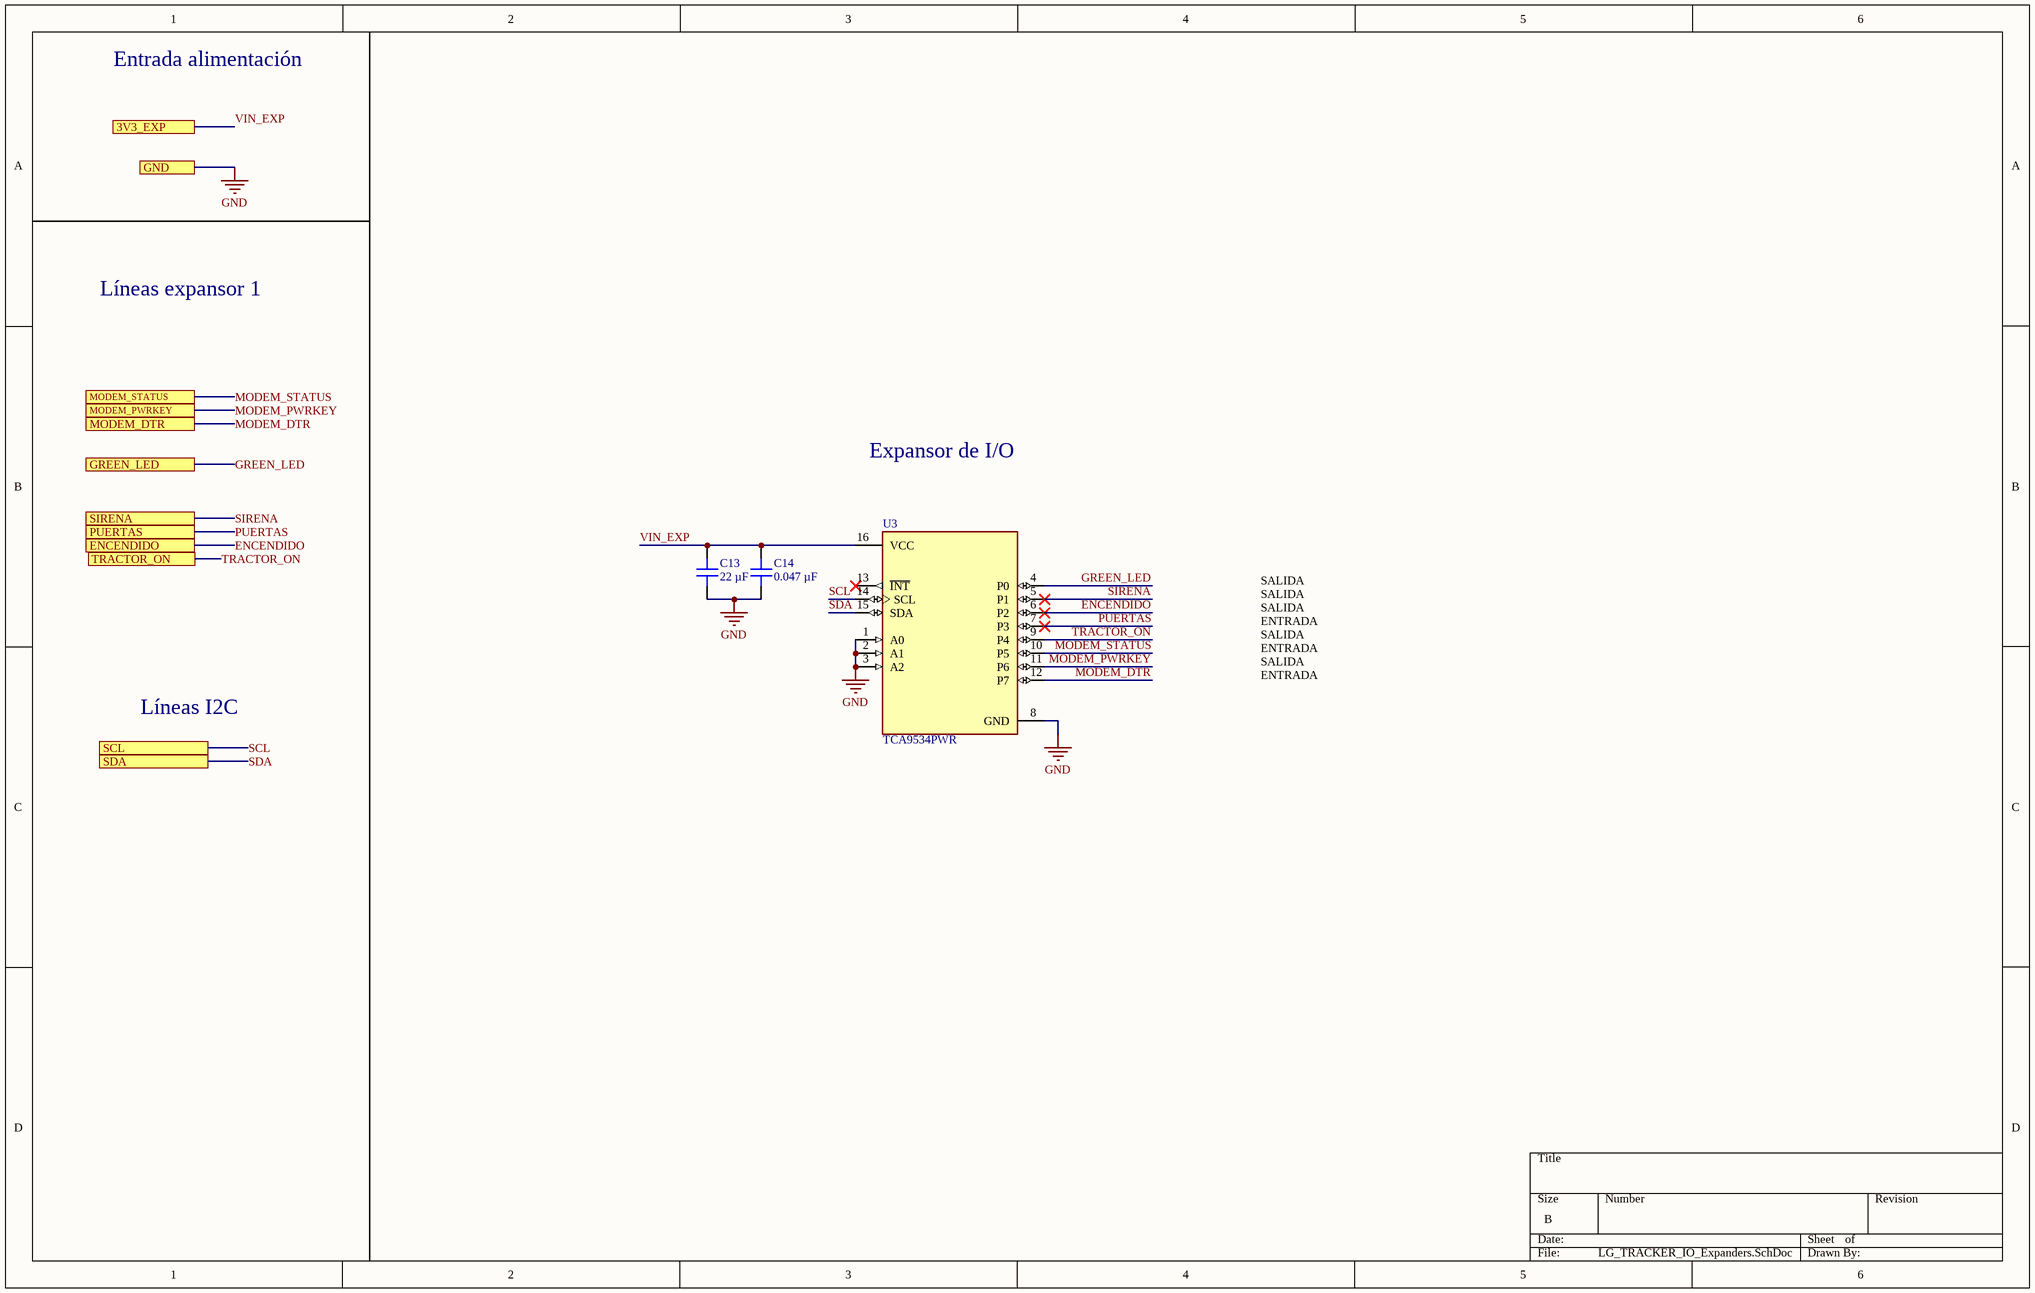
[diagram p3: LG_TRACKER_IO_Expanders.SchDoc]

### Parts
C13  22 µF  [CAP 0805_2012]
C14  0.047 µF  [CAP 0603_1608]
U3  TCA9534PWR  [16-TSSOP]

### Ports
3V3_EXP, ENCENDIDO, GND, GREEN_LED, MODEM_DTR, MODEM_PWRKEY, MODEM_STATUS, PUERTAS, SCL, SDA, SIRENA, TRACTOR_ON

### Nets
GND: C13.1 C14.1 U3.1(A0) U3.2(A1) U3.3(A2) U3.8(GND) ; port GND
VIN_EXP: C13.2 C14.2 U3.16(VCC) ; port 3V3_EXP  [project net 3V3_ESP32]
ENCENDIDO: U3.6(P2) ; port ENCENDIDO
GREEN_LED: U3.4(P0) ; port GREEN_LED
MODEM_DTR: U3.12(P7) ; port MODEM_DTR
MODEM_PWRKEY: U3.11(P6) ; port MODEM_PWRKEY
MODEM_STATUS: U3.10(P5) ; port MODEM_STATUS
PUERTAS: U3.7(P3) ; port PUERTAS
SCL: U3.14(SCL) ; port SCL
SDA: U3.15(SDA) ; port SDA
SIRENA: U3.5(P1) ; port SIRENA
TRACTOR_ON: U3.9(P4) ; port TRACTOR_ON

Not connected (* = marked no-connect by the designer): U3 13(~{INT})*

### Notes on the sheet
- Entrada alimentación
- Líneas expansor 1
- Expansor de I/O
- Líneas I2C
- SALIDA                                  SALIDA                      SALIDA                       ENTRADA                             SALIDA                              ENTRADA                                      SALIDA                                                                                                                      ENTRADA

### Library data of the parts
C13 = CL21A226MOCLRNC: as C11 on sheet LG_TRACKER_Microcontroller; Part Number: CL21A226MOCLRNC; Value: 22 µF; Applications: General Purpose; Capacitance: 22 µF; componentlink1description: Datasheet; componentlink1url: http://www.samsungsem.com/kr/support/product-search/mlcc/CL21A226MOCLRNC.jsp; componentlink2description: DigiKey Link; componentlink2url: https://www.digikey.com/en/products/detail/samsung-electro-mechanics/CL21A226MOCLRNC/5961264; Device Package: 0805 (2012 Metric); Features: Low Profile; lastupdated: 10/30/2023 7:14:19 PM; Lifecycle Status: Active; Minimum Order: 1; Mounting Type: Surface Mount, MLCC; Operating Temperature: -55°C ~ 85°C; Package / Case: 0805 (2012 Metric); packaging: TapeAndReel; partid: 4767; Part Status: Active; price: 0.05; series: CL; Size / Dimension: 0.079" L x 0.049" W (2.00mm x 1.25mm); Supplier 1: DigiKey; Supplier Part Number 1: 1276-6780-1-ND; Temperature Coefficient: X5R; Thickness (Max): 0.037" (0.95mm); Voltage - Rated: 16V
C14 = 885012206118: as C10 on sheet LG_TRACKER_Microcontroller; Part Number: 885012206118; Value: 0.047 µF; Applications: General Purpose; Capacitance: 0.047 µF; componentlink1description: Datasheet; componentlink1url: https://katalog.we-online.de/pbs/datasheet/885012206118.pdf; componentlink2description: DigiKey Link; componentlink2url: https://www.digikey.com/en/products/detail/würth-elektronik/885012206118/9346004; Device Package: 0603 (1608 Metric); lastupdated: 10/29/2023 7:09:06 PM; Lifecycle Status: Active; Minimum Order: 1; Mounting Type: Surface Mount, MLCC; Operating Temperature: -55°C ~ 125°C; Package / Case: 0603 (1608 Metric); packaging: TapeAndReel; partid: 11891; Part Status: Active; price: 0.06; series: WCAP-CSGP; Size / Dimension: 0.063" L x 0.031" W (1.60mm x 0.80mm); Supplier 1: DigiKey; Supplier Part Number 1: 732-12192-1-ND; Temperature Coefficient: X7R; Thickness (Max): 0.037" (0.95mm); Voltage - Rated: 100V
U3 = TCA9534PWR: Remote 8-Bit I2C Low-Power I/O Expander With Interrupt Output and Configuration Registers 16-TSSOP -40 to 85; Price: None; MP: TCA9534PWR; Availability: Unavailable; Package: None; Value: *

## Sheet LG_TRACKER_BG95.SchDoc
size B; Organization: Altium Limited; Address1: L3, 12a Rodborough Rd; Address2: Frenchs Forest; Address3: NSW; Address4: Australia 2086; SheetNumber: 7; SheetTotal: 16
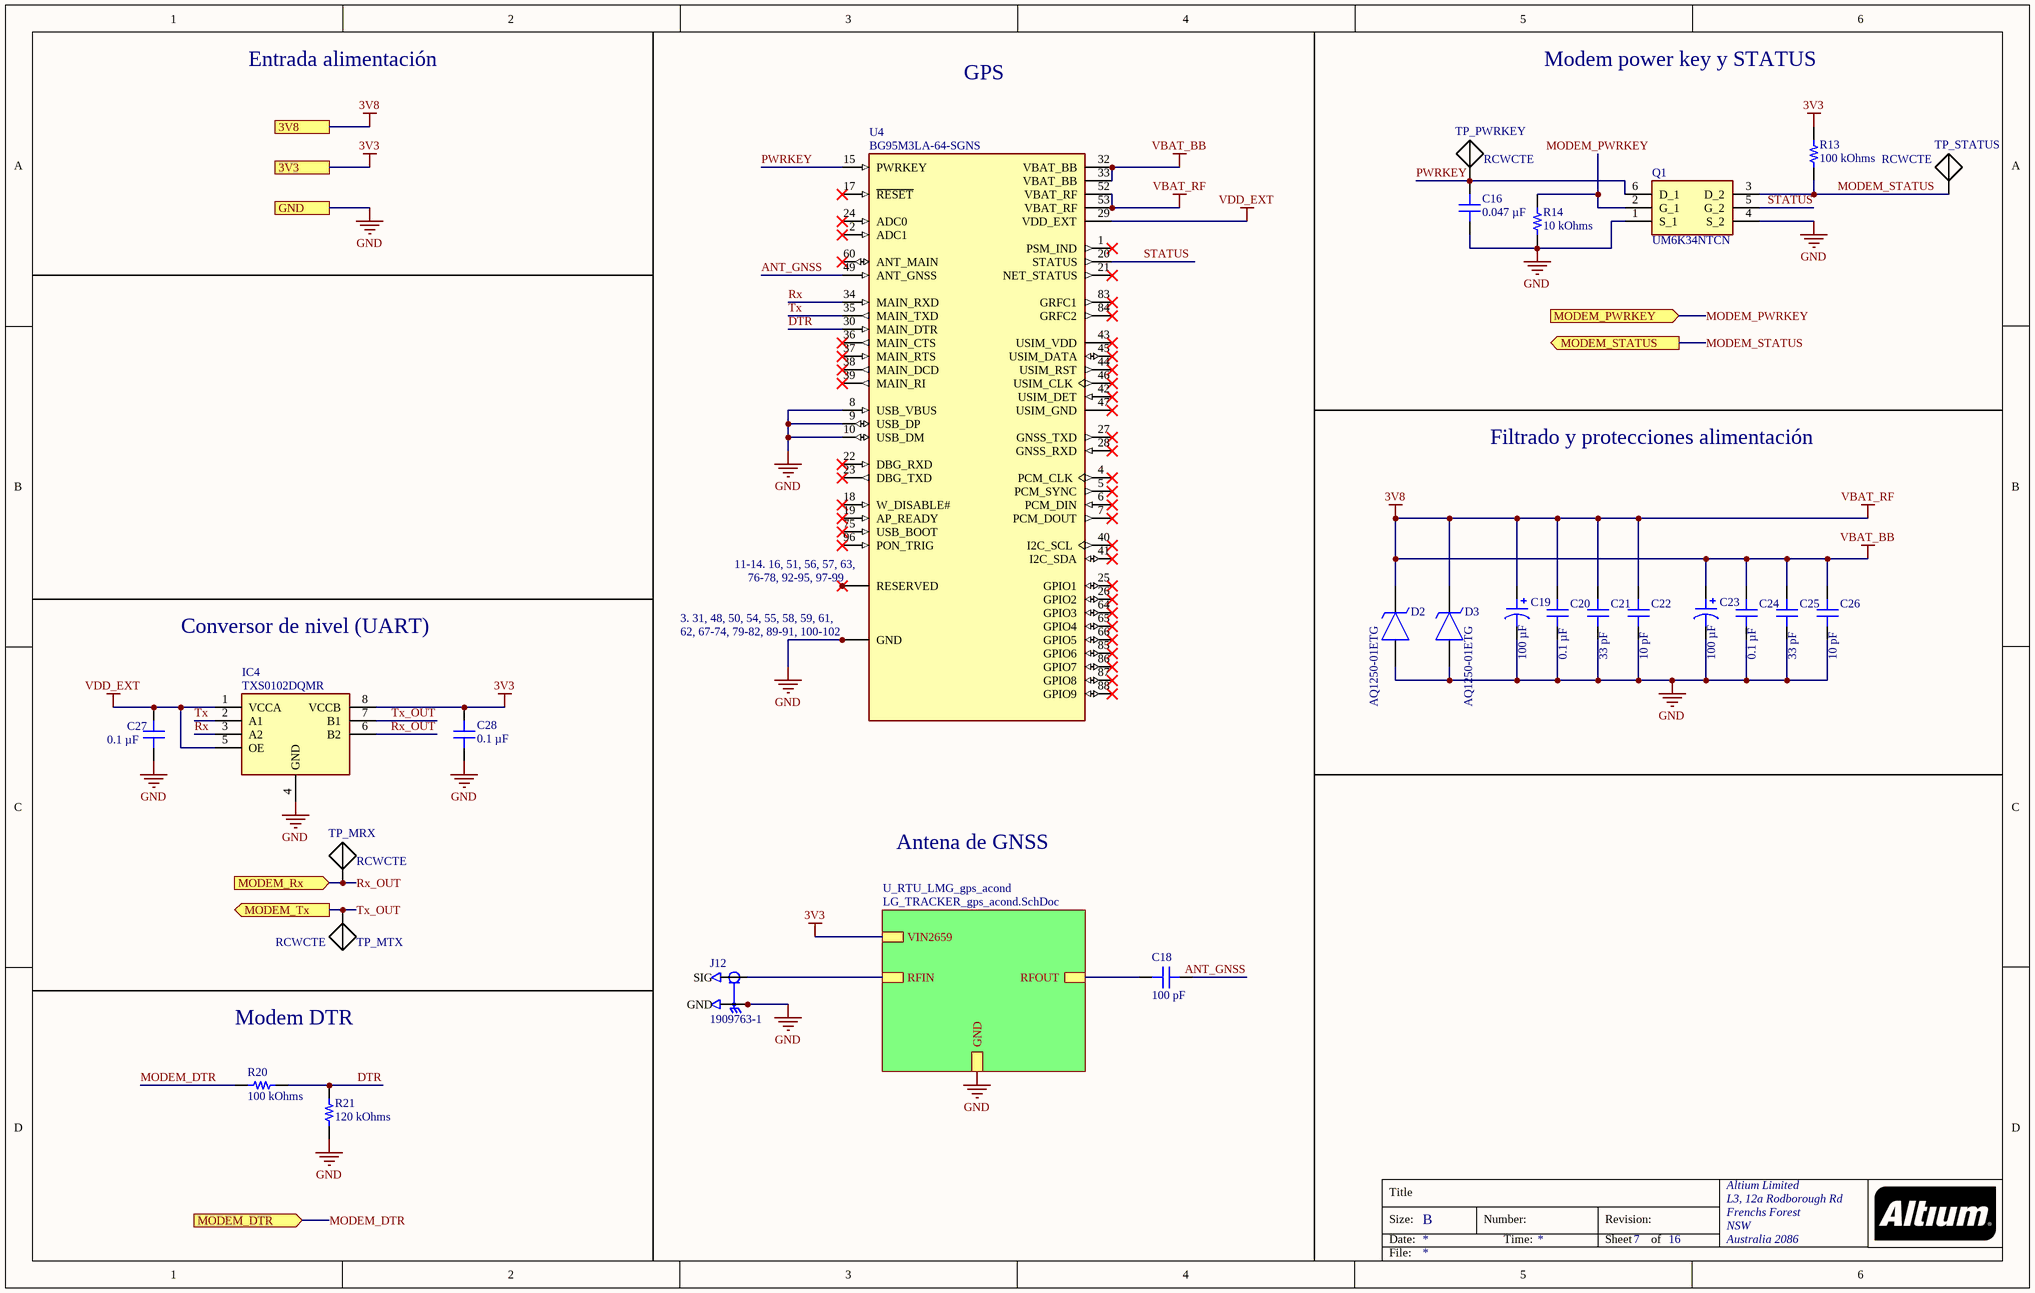
[diagram p4: LG_TRACKER_BG95.SchDoc]

### Parts
C16  0.047 µF  [CAP 0603_1608]
C18  100 pF  [CAP 0402_1005]
C19  100 µF  [CAP ALSMD ELEC 6.6MM H5.4MM]
C20  0.1 µF  [CAP 0402_1005]
C21  33 pF  [CAP 0402_1005]
C22  10 pF  [CAP 0402_1005]
C23  100 µF  [CAP ALSMD ELEC 6.6MM H5.4MM]
C24  0.1 µF  [CAP 0402_1005]
C25  33 pF  [CAP 0402_1005]
C26  10 pF  [CAP 0402_1005]
C27  0.1 µF  [CAP 0402_1005]
C28  0.1 µF  [CAP 0402_1005]
D2  AQ1250-01ETG  [SOD-882]
D3  AQ1250-01ETG  [SOD-882]
IC4  TXS0102DQMR  [8-X2SON]
J12  1909763-1  [TE_1909763-1]
Q1  UM6K34NTCN  [SOT-363]
R13  100 kOhms  [RES 0402_1005]
R14  10 kOhms  [RES 0603_1608]
R20  100 kOhms  [RES 0402_1005]
R21  120 kOhms  [RES 0402_1005]
TP_MRX  RCWCTE  [RCWCTE]
TP_MTX  RCWCTE  [RCWCTE]
TP_PWRKEY  RCWCTE  [RCWCTE]
TP_STATUS  RCWCTE  [RCWCTE]
U4  BG95M3LA-64-SGNS  [BG95M3LA-64-SGNS]

### Sub-sheets
U_RTU_LMG_gps_acond = LG_TRACKER_gps_acond.SchDoc (file not in this document): VIN2659, GND, RFOUT, RFIN

### Ports
3V3, 3V8, GND, MODEM_DTR (in), MODEM_PWRKEY (in), MODEM_Rx (in), MODEM_STATUS (out), MODEM_Tx (out)

### Nets
3V3: C28.2 IC4.8(VCCB) R13.2 ; port 3V3, sheet U_RTU_LMG_gps_acond/VIN2659
3V8: C19.1 C20.2 C21.1 C22.1 C23.1 C24.2 C25.1 C26.1 D2.1(K) D3.1(K) U4.32(VBAT_BB) U4.33(VBAT_BB) U4.52(VBAT_RF) U4.53(VBAT_RF) ; port 3V8  [also labelled VBAT_BB, VBAT_RF]
GND: C16.1 C19.2 C20.1 C21.2 C22.2 C23.2 C24.1 C25.2 C26.2 C27.1 C28.1 D2.2(A) D3.2(A) IC4.4(GND) J12.2(GND) J12.3(GND) Q1.1(S_1) Q1.4(S_2) R14.2 R21.1 U4.3(GND) U4.8(USB_VBUS) U4.9(USB_DP) U4.10(USB_DM) U4.31(GND) U4.48(GND) U4.50(GND) U4.54(GND) U4.55(GND) U4.58(GND) U4.59(GND) U4.61(GND) U4.62(GND) U4.67(GND) U4.68(GND) U4.69(GND) U4.70(GND) U4.71(GND) U4.72(GND) U4.73(GND) U4.74(GND) U4.79(GND) U4.80(GND) U4.81(GND) U4.82(GND) U4.89(GND) U4.90(GND) U4.91(GND) U4.100(GND) U4.101(GND) U4.102(GND) ; port GND, sheet U_RTU_LMG_gps_acond/GND
VDD_EXT: C27.2 IC4.1(VCCA) IC4.5(OE) U4.29(VDD_EXT)
ANT_GNSS: C18.1 U4.49(ANT_GNSS)
DTR: R20.1 R21.2 U4.30(MAIN_DTR)
MODEM_DTR: R20.2 ; port MODEM_DTR
MODEM_PWRKEY: Q1.2(G_1) R14.1 ; port MODEM_PWRKEY
MODEM_STATUS: Q1.3(D_2) R13.1 TP_STATUS.1(TP) ; port MODEM_STATUS
PWRKEY: C16.2 Q1.6(D_1) TP_PWRKEY.1(TP) U4.15(PWRKEY)
Rx: IC4.3(A2) U4.34(MAIN_RXD)
Rx_OUT: IC4.6(B2) TP_MRX.1(TP) ; port MODEM_Rx  [project net MODEM_RX]
STATUS: Q1.5(G_2) U4.20(STATUS)
Tx: IC4.2(A1) U4.35(MAIN_TXD)
Tx_OUT: IC4.7(B1) TP_MTX.1(TP) ; port MODEM_Tx  [project net MODEM_TX]
NetC18_2: C18.2 ; sheet U_RTU_LMG_gps_acond/RFOUT
NetJ12_1: J12.1(SIG) ; sheet U_RTU_LMG_gps_acond/RFIN
NetU4_11: U4.11(RESERVED) U4.12(RESERVED) U4.13(RESERVED) U4.14(RESERVED) U4.16(RESERVED) U4.51(RESERVED) U4.56(RESERVED) U4.57(RESERVED) U4.63(RESERVED) U4.76(RESERVED) U4.77(RESERVED) U4.78(RESERVED) U4.92(RESERVED) U4.93(RESERVED) U4.94(RESERVED) U4.95(RESERVED) U4.97(RESERVED) U4.98(RESERVED) U4.99(RESERVED)

Not connected (* = marked no-connect by the designer): U4 1(PSM_IND)* 2(ADC1)* 4(PCM_CLK)* 5(PCM_SYNC)* 6(PCM_DIN)* 7(PCM_DOUT)* 17(~{RESET})* 18(W_DISABLE#)* 19(AP_READY)* 21(NET_STATUS)* 22(DBG_RXD)* 23(DBG_TXD)* 24(ADC0)* 25(GPIO1)* 26(GPIO2)* 27(GNSS_TXD)* 28(GNSS_RXD)* 36(MAIN_CTS)* 37(MAIN_RTS)* 38(MAIN_DCD)* 39(MAIN_RI)* 40(I2C_SCL)* 41(I2C_SDA)* 42(USIM_DET)* 43(USIM_VDD)* 44(USIM_RST)* 45(USIM_DATA)* 46(USIM_CLK)* 47(USIM_GND)* 60(ANT_MAIN)* 64(GPIO3)* 65(GPIO4)* 66(GPIO5)* 75(USB_BOOT)* 83(GRFC1)* 84(GRFC2)* 85(GPIO6)* 86(GPIO7)* 87(GPIO8)* 88(GPIO9)* 96(PON_TRIG)*

### Notes on the sheet
- Entrada alimentación
- GPS
- Modem power key y STATUS
- Filtrado y protecciones alimentación
- Conversor de nivel (UART)
- Antena de GNSS
- Modem DTR
- Title
- Size:
- Date:
- B
- Number:
- Time:
- Revision:
- Sheet
- of
- File:
- (in symbol BG95M3LA-64-SGNS) 11-14. 16, 51, 56, 57, 63,; 76-78, 92-95, 97-99; 3. 31, 48, 50, 54, 55, 58, 59, 61,; 62, 67-74, 79-82, 89-91, 100-102

### Library data of the parts
C16 = 885012206118: as C10 on sheet LG_TRACKER_Microcontroller; Part Number: 885012206118; Value: 0.047 µF; Applications: General Purpose; Capacitance: 0.047 µF; componentlink1description: Datasheet; componentlink1url: https://katalog.we-online.de/pbs/datasheet/885012206118.pdf; componentlink2description: DigiKey Link; componentlink2url: https://www.digikey.com/en/products/detail/würth-elektronik/885012206118/9346004; Device Package: 0603 (1608 Metric); lastupdated: 10/29/2023 7:09:06 PM; Lifecycle Status: Active; Minimum Order: 1; Mounting Type: Surface Mount, MLCC; Operating Temperature: -55°C ~ 125°C; Package / Case: 0603 (1608 Metric); packaging: TapeAndReel; partid: 11891; Part Status: Active; price: 0.06; series: WCAP-CSGP; Size / Dimension: 0.063" L x 0.031" W (1.60mm x 0.80mm); Supplier 1: DigiKey; Supplier Part Number 1: 732-12192-1-ND; Temperature Coefficient: X7R; Thickness (Max): 0.037" (0.95mm); Voltage - Rated: 100V
C18 = CC0402FRNPO9BN101: CAP CER 100PF 50V C0G/NPO 0402; manufacturer: Yageo; Temperature Coefficient: C0G, NP0; Tolerance: ±1%; Part Number: CC0402FRNPO9BN101; Value: 100 pF; Applications: General Purpose; Capacitance: 100 pF; componentlink1description: Datasheet; componentlink1url: https://www.yageo.com/upload/media/product/productsearch/datasheet/mlcc/UPY-GP_NP0_16V-to-50V_17.pdf; componentlink2description: DigiKey Link; componentlink2url: https://www.digikey.com/en/products/detail/yageo/CC0402FRNPO9BN101/5021207; Device Package: 0402 (1005 Metric); lastupdated: 11/1/2023 7:04:19 PM; Lifecycle Status: Active; Minimum Order: 1; Mounting Type: Surface Mount, MLCC; Operating Temperature: -55°C ~ 125°C; Package / Case: 0402 (1005 Metric); packaging: TapeAndReel; partid: 8397; Part Status: Active; price: 0.01; series: CC; Size / Dimension: 0.039" L x 0.020" W (1.00mm x 0.50mm); Supplier 1: DigiKey; Supplier Part Number 1: 311-3329-1-ND; Thickness (Max): 0.022" (0.55mm); Voltage - Rated: 50V
C19 C23 = 865080343009: CAP ALUM 100UF 20% 16V SMD; manufacturer: Würth Elektronik; Impedance: 520 mOhms; Lifetime @ Temp.: 2000 Hrs @ 105°C; Polarization: Polar; Ripple Current @ High Frequency: 255 mA @ 100 kHz; Ripple Current @ Low Frequency: 165.75 mA @ 120 Hz; Surface Mount Land Size: 0.260" L x 0.260" W (6.60mm x 6.60mm); Part Number: 865080343009; Applications: General Purpose; Capacitance: 100 µF; componentlink1description: Datasheet; componentlink1url: https://katalog.we-online.de/pbs/datasheet/865080343009.pdf; componentlink2description: DigiKey Link; componentlink2url: https://www.digikey.com/en/products/detail/würth-elektronik/865080343009/5728014; Device Package: Radial, Can - SMD; Height - Seated (Max): 0.217" (5.50mm); lastupdated: 10/31/2023 8:16:49 PM; Lifecycle Status: Active; Minimum Order: 1; Mounting Type: Surface Mount; Operating Temperature: -55°C ~ 105°C; Package / Case: Radial, Can - SMD; packaging: TapeAndReel; partid: 8820; Part Status: Active; price: 0.16; series: WCAP-ASLI; Size / Dimension: 0.248" Dia (6.30mm); Supplier 1: DigiKey; Supplier Part Number 1: 732-8419-1-ND; Tolerance: ±20%; value: 100 µF; Voltage - Rated: 16 V
C20 C24 C27 C28 = GRM155R71H104KE14D: CAP CER 0.1UF 50V X7R 0402; manufacturer: Murata Electronics; Tolerance: ±10%; Part Number: GRM155R71H104KE14D; Value: 0.1 µF; Applications: General Purpose; Capacitance: 0.1 µF; componentlink1description: Datasheet; componentlink1url: https://search.murata.co.jp/Ceramy/image/img/A01X/G101/ENG/GRM155R71H104KE14-01.pdf; componentlink2description: DigiKey Link; componentlink2url: https://www.digikey.com/en/products/detail/murata-electronics/GRM155R71H104KE14D/4906220; Device Package: 0402 (1005 Metric); lastupdated: 10/30/2023 7:04:06 PM; Lifecycle Status: Active; Minimum Order: 1; Mounting Type: Surface Mount, MLCC; Operating Temperature: -55°C ~ 125°C; Package / Case: 0402 (1005 Metric); packaging: CutTape; partid: 12677; Part Status: Active; price: 0.01; series: GRM; Size / Dimension: 0.039" L x 0.020" W (1.00mm x 0.50mm); Supplier 1: DigiKey; Supplier Part Number 1: 490-10700-1-ND; Temperature Coefficient: X7R; Thickness (Max): 0.022" (0.55mm); Voltage - Rated: 50V
C21 C25 = CC0402GRNPO9BN330: CAP CER 33PF 50V C0G/NPO 0402; manufacturer: Yageo; Temperature Coefficient: C0G, NP0; Tolerance: ±2%; Part Number: CC0402GRNPO9BN330; Value: 33 pF; Applications: General Purpose; Capacitance: 33 pF; componentlink1description: Datasheet; componentlink1url: https://www.yageo.com/upload/media/product/productsearch/datasheet/mlcc/UPY-GP_NP0_16V-to-50V_17.pdf; componentlink2description: DigiKey Link; componentlink2url: https://www.digikey.com/en/products/detail/yageo/CC0402GRNPO9BN330/5195063; Device Package: 0402 (1005 Metric); lastupdated: 11/1/2023 7:04:30 PM; Lifecycle Status: Active; Minimum Order: 1; Mounting Type: Surface Mount, MLCC; Operating Temperature: -55°C ~ 125°C; Package / Case: 0402 (1005 Metric); packaging: TapeAndReel; partid: 1910; Part Status: Active; price: 0.01; series: CC; Size / Dimension: 0.039" L x 0.020" W (1.00mm x 0.50mm); Supplier 1: DigiKey; Supplier Part Number 1: 311-1654-1-ND; Thickness (Max): 0.022" (0.55mm); Voltage - Rated: 50V
C22 C26 = CC0402DRNPO9BN100: CAP CER 10PF 50V C0G/NPO 0402; manufacturer: Yageo; Temperature Coefficient: C0G, NP0; Tolerance: ±0.5pF; Part Number: CC0402DRNPO9BN100; Value: 10 pF; Applications: General Purpose; Capacitance: 10 pF; componentlink1description: Datasheet; componentlink1url: https://www.yageo.com/upload/media/product/productsearch/datasheet/mlcc/UPY-GP_NP0_16V-to-50V_17.pdf; componentlink2description: DigiKey Link; componentlink2url: https://www.digikey.com/en/products/detail/yageo/CC0402DRNPO9BN100/2297890; Device Package: 0402 (1005 Metric); lastupdated: 11/1/2023 7:04:26 PM; Lifecycle Status: Active; Minimum Order: 1; Mounting Type: Surface Mount, MLCC; Operating Temperature: -55°C ~ 125°C; Package / Case: 0402 (1005 Metric); packaging: CutTape; partid: 3899; Part Status: Active; price: 0.01; series: CC; Size / Dimension: 0.039" L x 0.020" W (1.00mm x 0.50mm); Supplier 1: DigiKey; Supplier Part Number 1: 311-3651-1-ND; Thickness (Max): 0.022" (0.55mm); Voltage - Rated: 50V
D2 D3 = AQ1250-01ETG: TVS Diode (Uni-directional) - VRMW =5V - VBR = 5.5 V; Manufacturer_Name: LITTELFUSE; Datasheet Link: https://www.littelfuse.com/~/media/electronics/datasheets/tvs_diode_arrays/littelfuse_tvs_diode_array_aq1250-01etg_datasheet.pdf.pdf; Height: 0.55mm; Manufacturer_Part_Number: AQ1250-01ETG; Mouser Part Number: 576-AQ1250-01ETG; Mouser Price/Stock: https://www.mouser.co.uk/ProductDetail/Littelfuse/AQ1250-01ETG?qs=iLbezkQI%252BsgYBFHNQL11bg%3D%3D
IC4 = TXS0102DQMR: Conversor de nivel lógico bidireccional 1.8-3.3 V; Manufacturer_Name: Texas Instruments; Datasheet Link: http://www.ti.com/lit/gpn/txs0102; Height: 0.4mm; Manufacturer_Part_Number: TXS0102DQMR; Mouser Part Number: 595-TXS0102DQMR; Mouser Price/Stock: https://www.mouser.co.uk/ProductDetail/Texas-Instruments/TXS0102DQMR?qs=l3GMcByk76LwJNFmr1RbWA%3D%3D; Arrow Part Number: TXS0102DQMR; Arrow Price/Stock: https://www.arrow.com/en/products/txs0102dqmr/texas-instruments?region=nac
J12 = 1909763-1: Conector antena Coaxial PL 50Ohm Solder ST SMD Gold Over Nickel T/R; MF: TE Connectivity; Purchase-URL: https://pricing.snapeda.com/search/part/1909763-1/?ref=eda; Package: None; Check_prices: https://www.snapeda.com/parts/1909763-1/TE+Connectivity+AMP+Connectors/view-part/?ref=eda; Value: *; SnapEDA_Link: https://www.snapeda.com/parts/1909763-1/TE+Connectivity+AMP+Connectors/view-part/?ref=snap; MP: 1909763-1; Digi-Key_Part_Number: A118077TR-ND
Q1 = UM6K34NTCN: Array 2 MOSFET (N-Channel); Manufacturer_Name: ROHM Semiconductor; Datasheet Link: https://datasheet.datasheetarchive.com/originals/distributors/DKDS-18/357292.pdf; Height: 1mm; Manufacturer_Part_Number: UM6K34NTCN; Mouser Part Number: 755-UM6K34NTCN; Mouser Price/Stock: https://www.mouser.co.uk/ProductDetail/ROHM-Semiconductor/UM6K34NTCN?qs=npTsUczJOtMIn9jsho046Q%3D%3D
R13 R20 = CRCW0402100KFKED: RES SMD 100K OHM 1% 1/16W 0402; Manufacturer: Vishay Dale; Power (Watts): 0.063W, 1/16W; Temperature Coefficient: ±100ppm/°C; Part Number: CRCW0402100KFKED; Value: 100 kOhms; ComponentLink1Description: Datasheet; ComponentLink1URL: http://www.vishay.com/docs/20035/dcrcwe3.pdf; ComponentLink2Description: DigiKey Link; ComponentLink2URL: https://www.digikey.com/en/products/detail/vishay-dale/CRCW0402100KFKED/1178235; Composition: Thick Film; Device Package: 0402 (1005 Metric); Features: Automotive AEC-Q200; Height - Seated (Max): 0.016" (0.40mm); LastUpdated: 11/1/2023 7:27:47 PM; Lifecycle Status: Active; Minimum Order: 1; Number of Terminations: 2; Operating Temperature: -55°C ~ 155°C; Package / Case: 0402 (1005 Metric); Packaging: CutTape; PartId: 11959; Part Status: Active; Price: 0.01; Ratings: AEC-Q200; Resistance: 100 kOhms; Series: CRCW; Size / Dimension: 0.039" L x 0.020" W (1.00mm x 0.50mm); Supplier 1: DigiKey; Supplier Part Number 1: 541-100KLCT-ND; Supplier Device Package: 0402; Tolerance: ±1%
R14 = RC0603FR-0710KL: as R5 on sheet LG_TRACKER_Microcontroller; Part Number: RC0603FR-0710KL; Value: 10 kOhms; ComponentLink1Description: Datasheet; ComponentLink1URL: https://www.yageo.com/upload/media/product/productsearch/datasheet/rchip/PYu-RC_Group_51_RoHS_L_10.pdf; ComponentLink2Description: DigiKey Link; ComponentLink2URL: https://www.digikey.com/en/products/detail/yageo/RC0603FR-0710KL/726880; Composition: Thick Film; Device Package: 0603 (1608 Metric); Features: Moisture Resistant; Height - Seated (Max): 0.022" (0.55mm); LastUpdated: 10/30/2023 7:36:43 PM; Lifecycle Status: Active; Minimum Order: 1; Number of Terminations: 2; Operating Temperature: -55°C ~ 155°C; Package / Case: 0603 (1608 Metric); Packaging: CutTape; PartId: 22599; Part Status: Active; Price: 0.01; Resistance: 10 kOhms; Series: RC_L; Size / Dimension: 0.063" L x 0.031" W (1.60mm x 0.80mm); Supplier 1: DigiKey; Supplier Part Number 1: 311-10.0KHRCT-ND; Supplier Device Package: 0603; Tolerance: ±1%
R21 = RMCF0402FT120K: RES 120K OHM 1% 1/16W 0402; Manufacturer: Stackpole Electronics Inc; Power (Watts): 0.063W, 1/16W; Temperature Coefficient: ±100ppm/°C; Part Number: RMCF0402FT120K; Value: 120 kOhms; ComponentLink1Description: Datasheet; ComponentLink1URL: https://www.seielect.com/catalog/sei-rmcf_rmcp.pdf; ComponentLink2Description: DigiKey Link; ComponentLink2URL: https://www.digikey.com/en/products/detail/stackpole-electronics-inc/RMCF0402FT120K/1761420; Composition: Thick Film; Device Package: 0402 (1005 Metric); Features: Automotive AEC-Q200; Height - Seated (Max): 0.016" (0.40mm); LastUpdated: 11/1/2023 7:28:14 PM; Lifecycle Status: Active; Minimum Order: 1; Number of Terminations: 2; Operating Temperature: -55°C ~ 155°C; Package / Case: 0402 (1005 Metric); Packaging: CutTape; PartId: 5008; Part Status: Active; Price: 0.01; Ratings: AEC-Q200; Resistance: 120 kOhms; Series: RMCF; Size / Dimension: 0.039" L x 0.020" W (1.00mm x 0.50mm); Supplier 1: DigiKey; Supplier Part Number 1: RMCF0402FT120KCT-ND; Supplier Device Package: 0402; Tolerance: ±1%
TP_MRX TP_MTX TP_PWRKEY TP_STATUS = RCWCTE: as TP_SCL on sheet LG_TRACKER_Microcontroller; Check_prices: https://www.snapeda.com/parts/RCWCTE/KOA+Speer/view-part/?ref=eda; SnapEDA_Link: https://www.snapeda.com/parts/RCWCTE/KOA+Speer/view-part/?ref=snap; Digi-Key_Part_Number: 2019-RCWCTETR-ND; Value: *; Purchase-URL: https://pricing.snapeda.com/search/part/RCWCTE/?ref=eda; Package: None; MP: RCWCTE
U4 = BG95M3LA-64-SGNS: Quectel BG95 Series LTE Cat M1/ Cat NB2/ EGPRS Module; MF: Quectel Wireless Solutions Co., Ltd; Purchase-URL: https://pricing.snapeda.com/search/part/BG95M3LA-64-SGNS/?ref=eda; Digi-Key_Part_Number: 2958-BG95M3LA-64-SGNSCT-ND; Check_prices: https://www.snapeda.com/parts/BG95M3LA-64-SGNS/Quectel/view-part/?ref=eda; Value: *; MP: BG95M3LA-64-SGNS; Package: Non-Standard Quectel; SnapEDA_Link: https://www.snapeda.com/parts/BG95M3LA-64-SGNS/Quectel/view-part/?ref=snap

## Sheet LG_TRACKER_Linear_Voltage_Regulator_3V3.SchDoc
size A; Organization: Altium Limited; Address1: L3, 12a Rodborough Rd; Address2: Frenchs Forest; Address3: NSW; Address4: Australia 2086; SheetNumber: 3; SheetTotal: 17
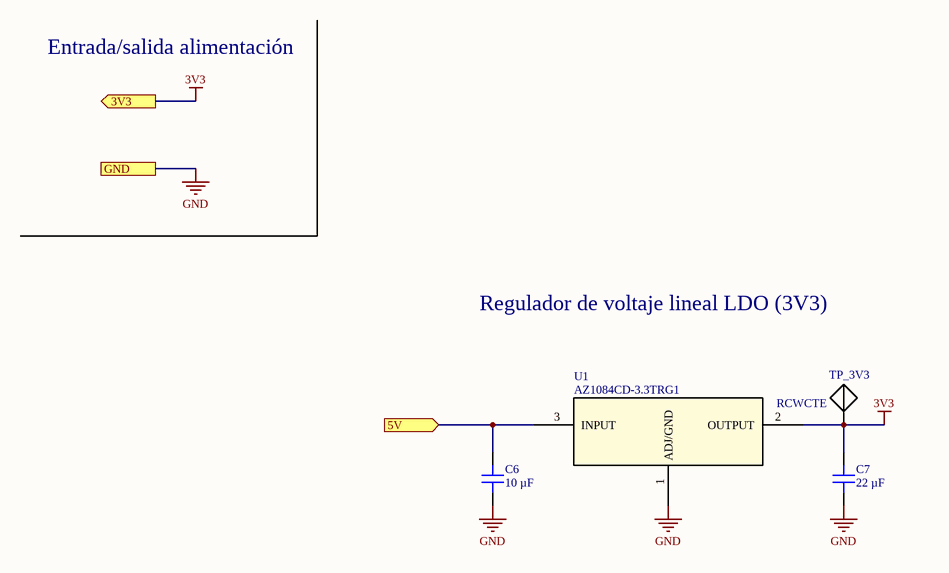
[diagram p5: LG_TRACKER_Linear_Voltage_Regulator_3V3.SchDoc]

### Parts
C6  10 µF  [CAP 1210_3225 - 1MM]
C7  22 µF  [CAP 0805_2012]
TP_3V3  RCWCTE  [RCWCTE]
U1  AZ1084CD-3.3TRG1  [TO252-3]

### Ports
3V3 (out), 5V (in), GND

### Nets
3V3: C7.2 TP_3V3.1(TP) U1.2(OUTPUT) ; port 3V3
5V: C6.1 U1.3(INPUT) ; port 5V
GND: C6.2 C7.1 U1.1(ADJ/GND) ; port GND

### Notes on the sheet
- Entrada/salida alimentación
- Regulador de voltaje lineal LDO (3V3)
- Title
- Size:
- Date:
- A
- Number:
- Time:
- Revision:
- Sheet
- of

### Library data of the parts
C6 = C3225X7R1N106K250AC: CAP CER 10UF 75V X7R 1210; manufacturer: TDK Corporation; Tolerance: ±10%; Part Number: C3225X7R1N106K250AC; Value: 10 µF; Applications: General Purpose; Capacitance: 10 µF; componentlink1description: Datasheet; componentlink1url: https://product.tdk.com/info/en/catalog/datasheets/mlcc_commercial_general_en.pdf?ref_disty=digikey; componentlink2description: DigiKey Link; componentlink2url: https://www.digikey.com/en/products/detail/tdk-corporation/C3225X7R1N106K250AC/10413502; Device Package: 1210 (3225 Metric); Features: Low ESL; lastupdated: 10/29/2023 7:38:56 PM; Lifecycle Status: Active; Minimum Order: 1; Mounting Type: Surface Mount, MLCC; Operating Temperature: -55°C ~ 125°C; Package / Case: 1210 (3225 Metric); packaging: TapeAndReel; partid: 45109; Part Status: Active; price: 0.29; series: C; Size / Dimension: 0.126" L x 0.098" W (3.20mm x 2.50mm); Supplier 1: DigiKey; Supplier Part Number 1: 445-C3225X7R1N106K250ACCT-ND; Temperature Coefficient: X7R; Thickness (Max): 0.110" (2.80mm); Voltage - Rated: 75V
C7 = CL21A226MOCLRNC: as C11 on sheet LG_TRACKER_Microcontroller; Part Number: CL21A226MOCLRNC; Value: 22 µF; Applications: General Purpose; Capacitance: 22 µF; componentlink1description: Datasheet; componentlink1url: http://www.samsungsem.com/kr/support/product-search/mlcc/CL21A226MOCLRNC.jsp; componentlink2description: DigiKey Link; componentlink2url: https://www.digikey.com/en/products/detail/samsung-electro-mechanics/CL21A226MOCLRNC/5961264; Device Package: 0805 (2012 Metric); Features: Low Profile; lastupdated: 10/30/2023 7:14:19 PM; Lifecycle Status: Active; Minimum Order: 1; Mounting Type: Surface Mount, MLCC; Operating Temperature: -55°C ~ 85°C; Package / Case: 0805 (2012 Metric); packaging: TapeAndReel; partid: 4767; Part Status: Active; price: 0.05; series: CL; Size / Dimension: 0.079" L x 0.049" W (2.00mm x 1.25mm); Supplier 1: DigiKey; Supplier Part Number 1: 1276-6780-1-ND; Temperature Coefficient: X5R; Thickness (Max): 0.037" (0.95mm); Voltage - Rated: 16V
TP_3V3 = RCWCTE: as TP_SCL on sheet LG_TRACKER_Microcontroller; Check_prices: https://www.snapeda.com/parts/RCWCTE/KOA+Speer/view-part/?ref=eda; SnapEDA_Link: https://www.snapeda.com/parts/RCWCTE/KOA+Speer/view-part/?ref=snap; Digi-Key_Part_Number: 2019-RCWCTETR-ND; Value: *; Purchase-URL: https://pricing.snapeda.com/search/part/RCWCTE/?ref=eda; Package: None; MP: RCWCTE
U1 = AZ1084CD-3.3TRG1: Fuente regulada LDO - 3V3 - 5A; Mfr_Name: Diodes Inc; Copyright: Copyright (C) 2023 Ultra Librarian. All rights reserved.; Manufacturer_Part_Number: AZ1084CD-3.3TRG1; RefDes: RefDes; Type: DEV